# Altium project CHILD_BOARD.PrjPcb (part 1 of 2)
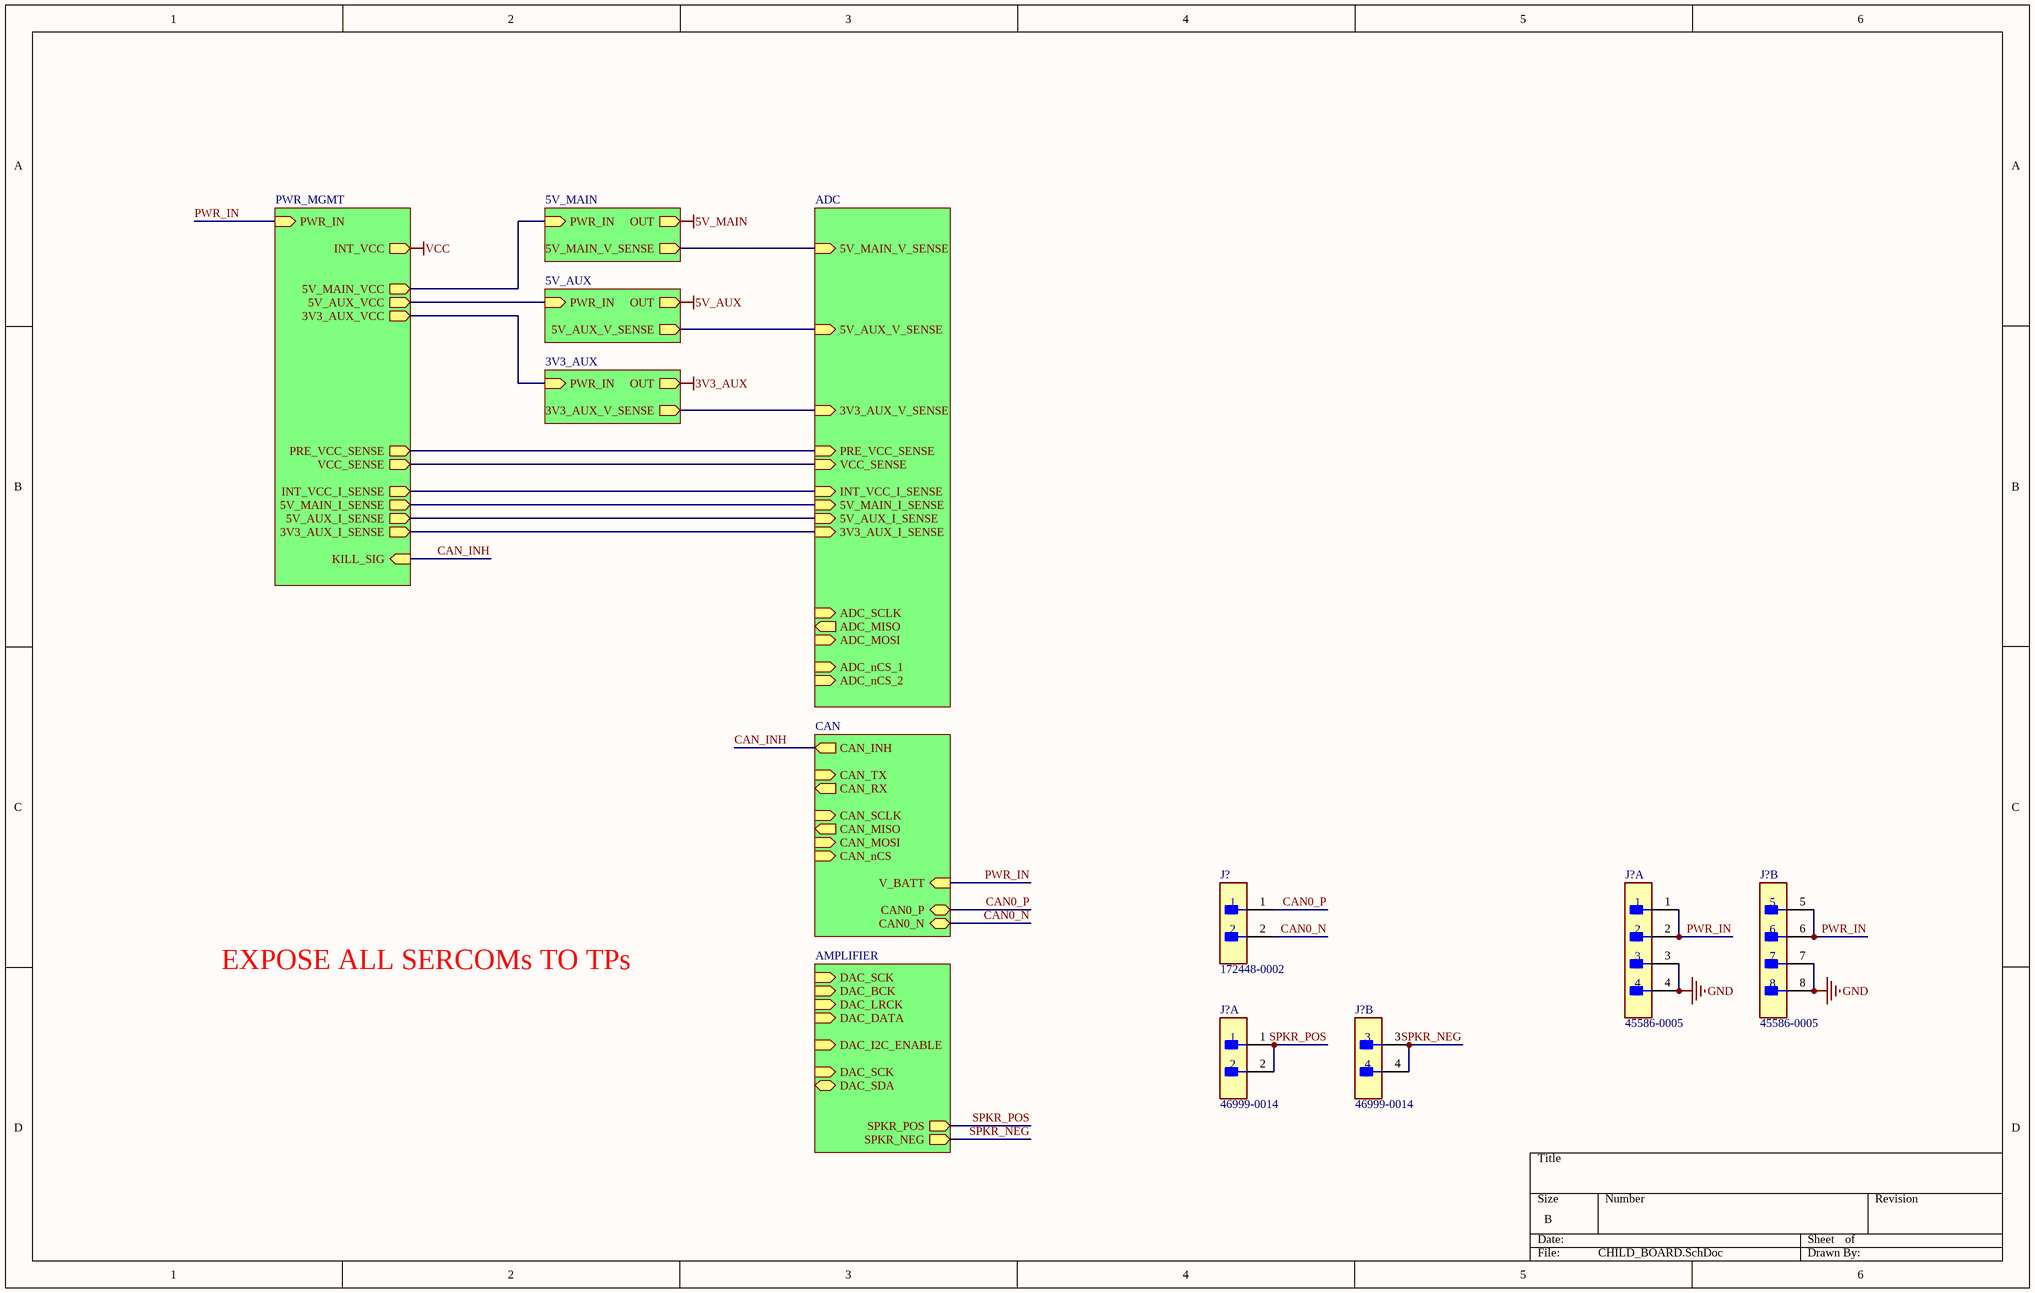
[diagram p0: CHILD_BOARD.SchDoc]
8 sheets, 164 parts. Net scope: hierarchical (ports join the sheet entries above them; power ports are global).
Board file: CHILD_BOARD.PcbDoc
Sheets:
  CHILD_BOARD.SchDoc
    PWR_MGMT = PWR_MGMT.SchDoc
    AMPLIFIER = AMPLIFIER.SchDoc
    CAN = CAN.SchDoc
    5V_MAIN = 5V_MAIN.SchDoc
    5V_AUX = 5V_AUX.SchDoc
    3V3_AUX = 3V3_AUX.SchDoc
    ADC = ADC.SchDoc

## Sheet CHILD_BOARD.SchDoc
size B; SheetNumber: 1; SheetTotal: 8

### Parts
(Parts that share a designator on the sheet are numbered #1, #2 ... from top to bottom, then left to right.)
J?#1  172448-0002  [FP-172448-0002-MFG]
J?#2  45586-0005  [FP-45586-0005-MFG]  (part A of 2)
J?#3  45586-0005  [FP-45586-0005-MFG]  (part B of 2)
J?#4  46999-0014  [FP-46999-0014-MFG]  (part A of 2)
J?#5  46999-0014  [FP-46999-0014-MFG]  (part B of 2)

### Sub-sheets
3V3_AUX = 3V3_AUX: PWR_IN (in), OUT (out), 3V3_AUX_V_SENSE (out)
5V_AUX = 5V_AUX: PWR_IN (in), OUT (out), 5V_AUX_V_SENSE (out)
5V_MAIN = 5V_MAIN: PWR_IN (in), OUT (out), 5V_MAIN_V_SENSE (out)
ADC = ADC: 5V_MAIN_V_SENSE (in), 3V3_AUX_V_SENSE (in), 5V_AUX_V_SENSE (in), INT_VCC_I_SENSE (in), 5V_MAIN_I_SENSE (in), 5V_AUX_I_SENSE (in), 3V3_AUX_I_SENSE (in), PRE_VCC_SENSE (in), VCC_SENSE (in), ADC_SCLK (in), ADC_MISO (out), ADC_MOSI (in), ADC_nCS_1 (in), ADC_nCS_2 (in)
AMPLIFIER = AMPLIFIER: DAC_SCK (in), DAC_BCK (in), DAC_LRCK (in), DAC_DATA (in), DAC_I2C_ENABLE (in), DAC_SCK (in), DAC_SDA (bidir), SPKR_POS (out), SPKR_NEG (out)
CAN = CAN: CAN_TX (in), CAN_RX (out), CAN_SCLK (in), CAN_MISO (out), CAN_MOSI (in), CAN_nCS (in), CAN_INH (out), CAN0_P (bidir), CAN0_N (bidir), V_BATT (in)
PWR_MGMT = PWR_MGMT: PWR_IN (in), INT_VCC (out), 5V_MAIN_VCC (out), 5V_AUX_VCC (out), 3V3_AUX_VCC (out), PRE_VCC_SENSE (out), VCC_SENSE (out), INT_VCC_I_SENSE (out), 5V_MAIN_I_SENSE (out), 5V_AUX_I_SENSE (out), 3V3_AUX_I_SENSE (out), KILL_SIG (in)

### Nets
GND: J?#2.3 J?#2.4 J?#3.7 J?#3.8
SPKR_NEG: J?#5.3 J?#5.4 ; sheet AMPLIFIER/SPKR_NEG
3V3_AUX_I_SENSE: sheet PWR_MGMT/3V3_AUX_I_SENSE, sheet ADC/3V3_AUX_I_SENSE
3V3_AUX_V_SENSE: sheet 3V3_AUX/3V3_AUX_V_SENSE, sheet ADC/3V3_AUX_V_SENSE
3V3_AUX_VCC: sheet PWR_MGMT/3V3_AUX_VCC, sheet 3V3_AUX/PWR_IN
5V_AUX_I_SENSE: sheet PWR_MGMT/5V_AUX_I_SENSE, sheet ADC/5V_AUX_I_SENSE
5V_AUX_V_SENSE: sheet 5V_AUX/5V_AUX_V_SENSE, sheet ADC/5V_AUX_V_SENSE
5V_AUX_VCC: sheet PWR_MGMT/5V_AUX_VCC, sheet 5V_AUX/PWR_IN
5V_MAIN_I_SENSE: sheet PWR_MGMT/5V_MAIN_I_SENSE, sheet ADC/5V_MAIN_I_SENSE
5V_MAIN_V_SENSE: sheet 5V_MAIN/5V_MAIN_V_SENSE, sheet ADC/5V_MAIN_V_SENSE
5V_MAIN_VCC: sheet PWR_MGMT/5V_MAIN_VCC, sheet 5V_MAIN/PWR_IN
CAN0_N: J?#1.2 ; sheet CAN/CAN0_N
CAN0_P: J?#1.1 ; sheet CAN/CAN0_P
CAN_INH: sheet PWR_MGMT/KILL_SIG, sheet CAN/CAN_INH
DAC_SCK: sheet AMPLIFIER/DAC_SCK, sheet AMPLIFIER/DAC_SCK
INT_VCC_I_SENSE: sheet PWR_MGMT/INT_VCC_I_SENSE, sheet ADC/INT_VCC_I_SENSE
PRE_VCC_SENSE: sheet PWR_MGMT/PRE_VCC_SENSE, sheet ADC/PRE_VCC_SENSE
PWR_IN: J?#2.1 J?#2.2 J?#3.5 J?#3.6 ; sheet PWR_MGMT/PWR_IN, sheet CAN/V_BATT
SPKR_POS: J?#4.1 J?#4.2 ; sheet AMPLIFIER/SPKR_POS
VCC_SENSE: sheet PWR_MGMT/VCC_SENSE, sheet ADC/VCC_SENSE

### Notes on the sheet
- EXPOSE ALL SERCOMs TO TPs

### Library data of the parts
J?#1 = CMP-04780-000002-1: CONN HEADER R/A 2POS; Row Spacing: 0.165inch; Number of Circuits: 2; Connector Type: Male Pin; Glow Wire Compliant: Compliant; Number of Pins: 2; Mount: Through Hole; Number of Positions: 2; Number of Rows: 2; Color: Black; Contact Plating: Tin; Fastening Type: Ramp; Termination: Solder; RoHS Compliant: Yes; Packaging: Tray; Orientation: Right Angle
J?#2 J?#3 = CMP-04776-000690-1: CONN HEADER R/A 8POS 4.2MM
J?#4 J?#5 = CMP-04776-000148-1: CONN HEADER R/A 4POS 4.2MM; Gender: Male; Mount: Through Hole; Number of Pins: 4; Termination: Solder; Pitch: 4.2mm; RoHS Compliant: Yes; Orientation: Right Angle

## Sheet PWR_MGMT.SchDoc
size C; SheetNumber: 2; SheetTotal: 8
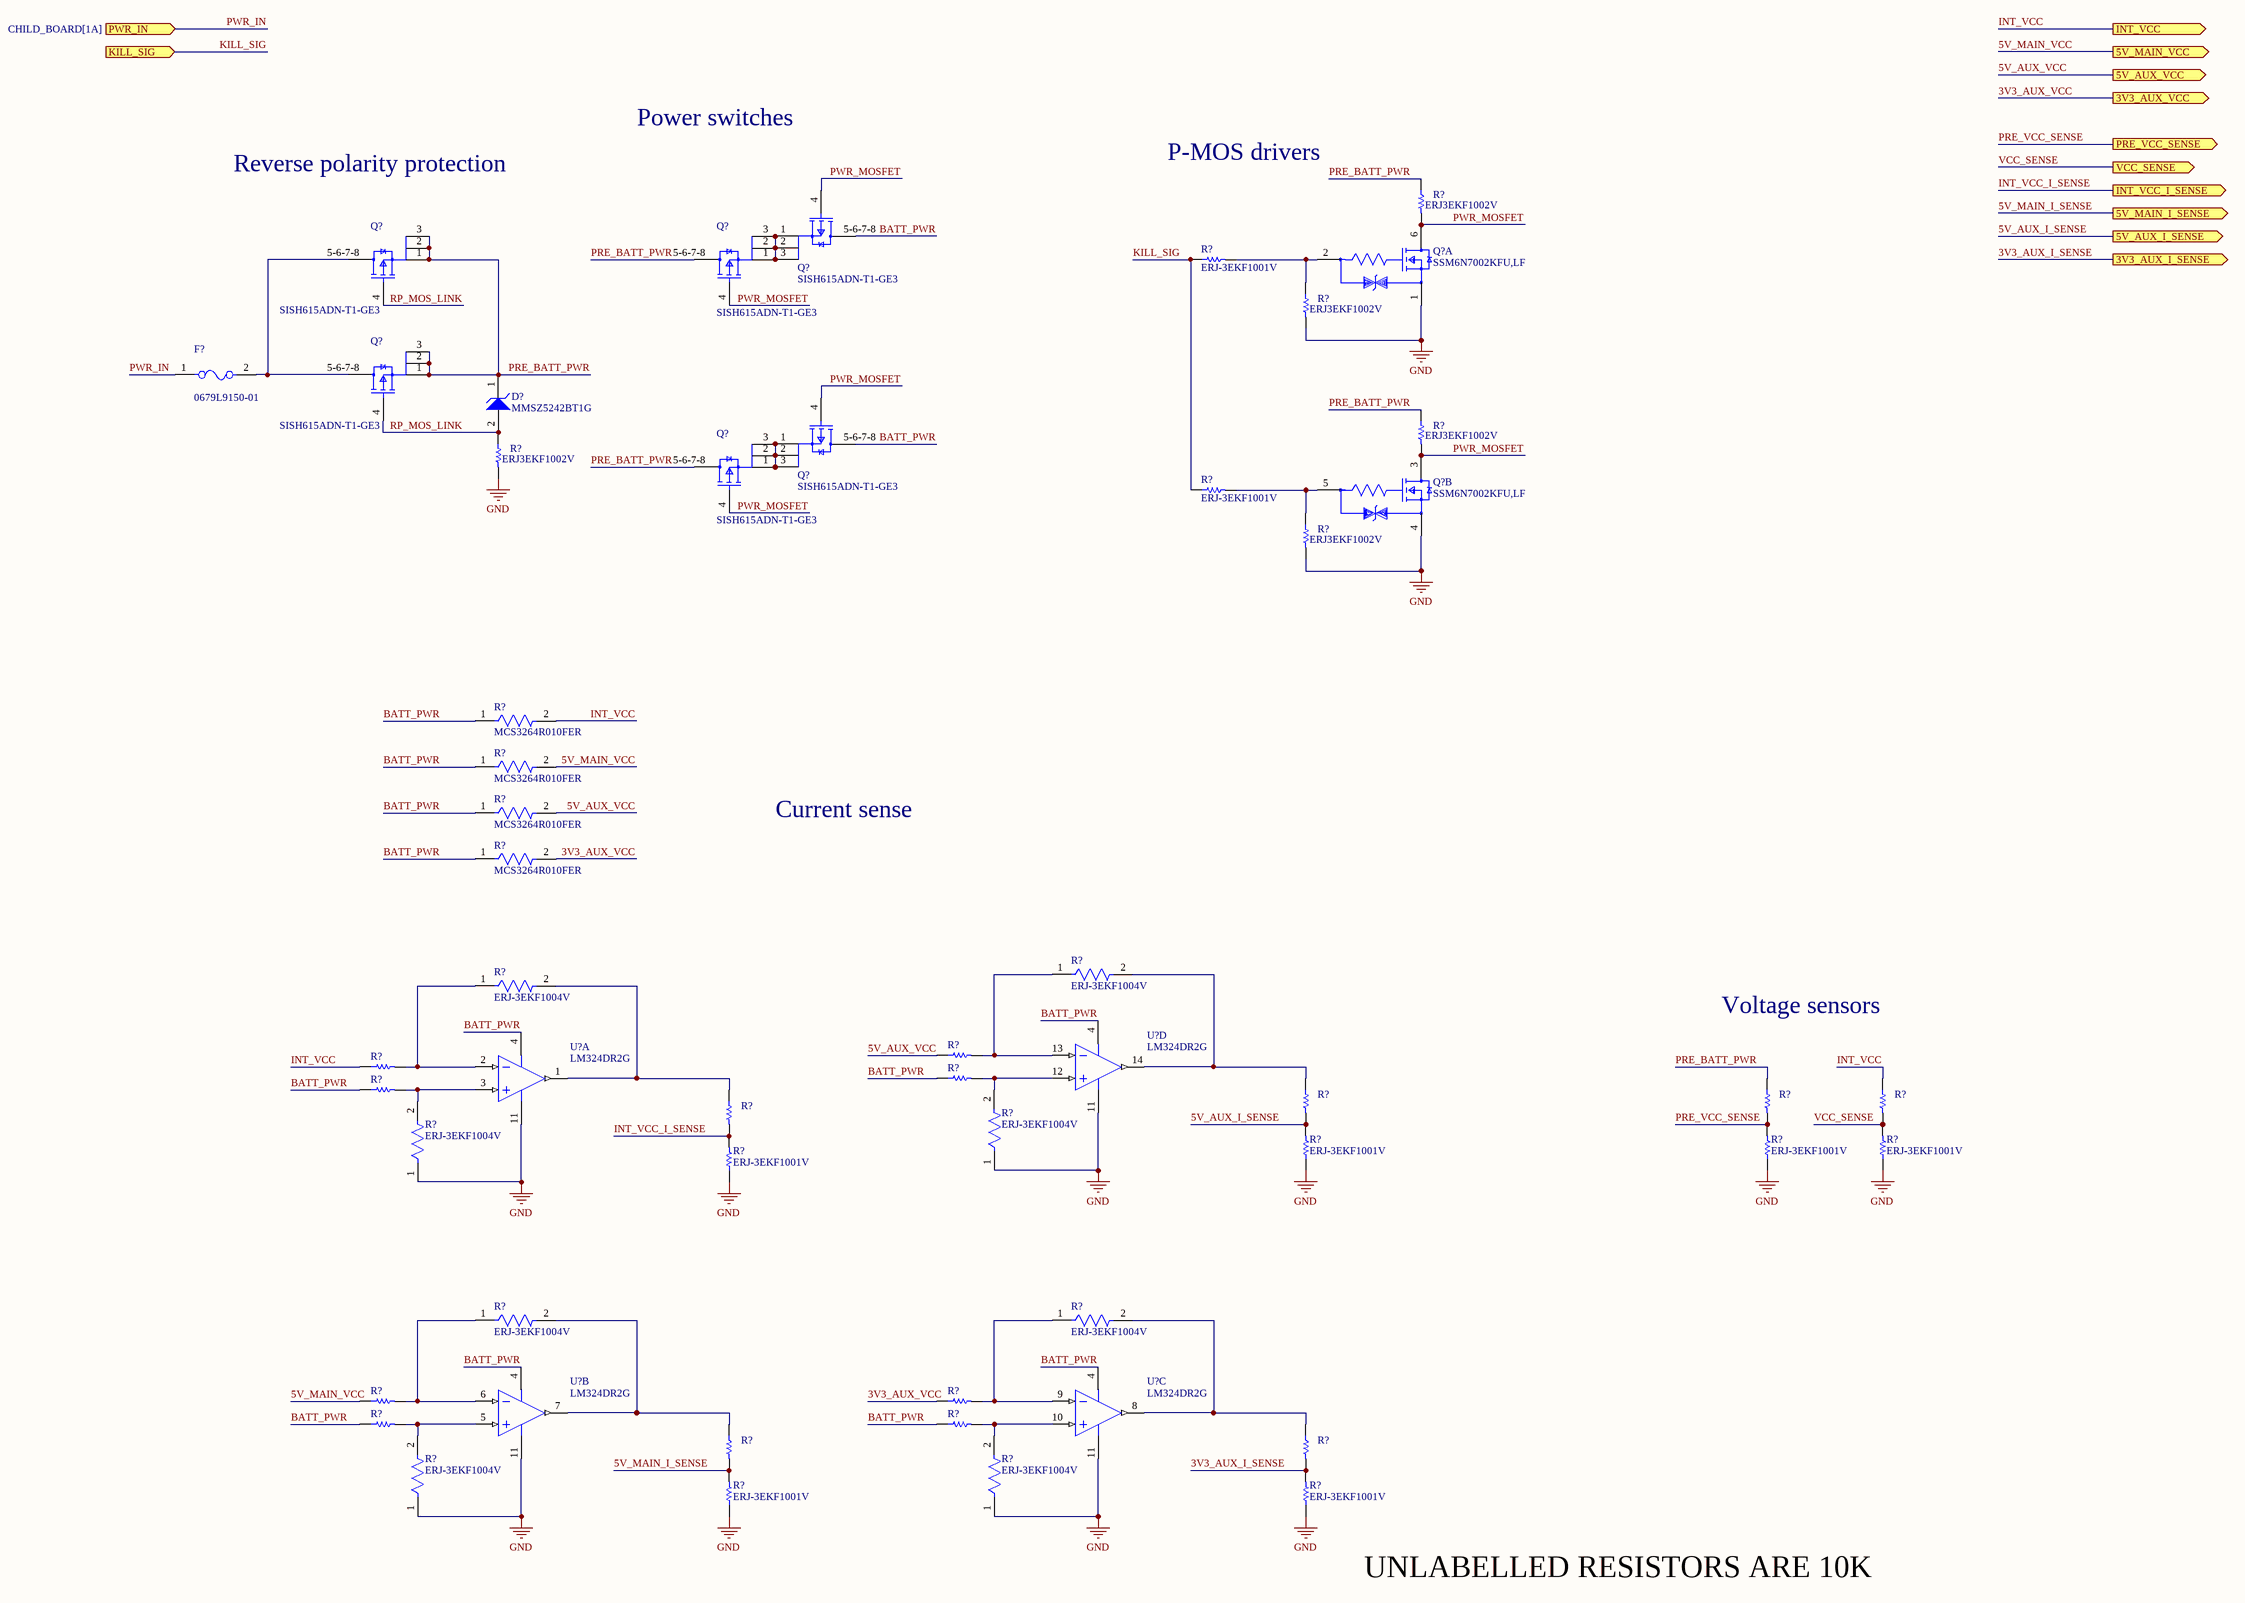
[diagram p1: PWR_MGMT.SchDoc]

### Parts
(Parts that share a designator on the sheet are numbered #1, #2 ... from top to bottom, then left to right.)
D?#1  MMSZ5242BT1G  [ONSC-SOD-123-2-425-04_V]
F?  0679L9150-01  [FP-0679L-MFG]
Q?#1  SISH615ADN-T1-GE3  [SISH615ADN-T1-GE3-Footprint-1]
Q?#2  SSM6N7002KFU,LF  [FP-SSOP6-P-0_65A-MFG]  (part A of 2)
Q?#3  SISH615ADN-T1-GE3  [SISH615ADN-T1-GE3-Footprint-1]
Q?#4  SISH615ADN-T1-GE3  [SISH615ADN-T1-GE3-Footprint-1]
Q?#5  SISH615ADN-T1-GE3  [SISH615ADN-T1-GE3-Footprint-1]
Q?#6  SISH615ADN-T1-GE3  [SISH615ADN-T1-GE3-Footprint-1]
Q?#7  SSM6N7002KFU,LF  [FP-SSOP6-P-0_65A-MFG]  (part B of 2)
Q?#8  SISH615ADN-T1-GE3  [SISH615ADN-T1-GE3-Footprint-1]
R?#1  ERJ3EKF1002V  [RESC1609X55X30LL15T15]
R?#2  ERJ-3EKF1001V  [RESC1608X55X30LL15T15]
R?#3  ERJ3EKF1002V  [RESC1609X55X30LL15T15]
R?#4  ERJ3EKF1002V  [RESC1609X55X30LL15T15]
R?#5  ERJ3EKF1002V  [RESC1609X55X30LL15T15]
R?#6  ERJ-3EKF1001V  [RESC1608X55X30LL15T15]
R?#7  ERJ3EKF1002V  [RESC1609X55X30LL15T15]
R?#8  MCS3264R010FER  [FP-MCS3264-MFG]
R?#9  MCS3264R010FER  [FP-MCS3264-MFG]
R?#10  MCS3264R010FER  [FP-MCS3264-MFG]
R?#11  MCS3264R010FER  [FP-MCS3264-MFG]
R?#12  ERJ-3EKF1004V  [FP-ERJ3EK-IPC_C]
R?#13  ERJ-3EKF1004V  [FP-ERJ3EK-IPC_C]
R?#14  ERJ3EKF1002V  [RESC1609X55X30LL15T15]  (value not drawn)
R?#15  ERJ3EKF1002V  [RESC1609X55X30LL15T15]  (value not drawn)
R?#16  ERJ3EKF1002V  [RESC1609X55X30LL15T15]  (value not drawn)
R?#17  ERJ3EKF1002V  [RESC1609X55X30LL15T15]  (value not drawn)
R?#18  ERJ3EKF1002V  [RESC1609X55X30LL15T15]  (value not drawn)
R?#19  ERJ3EKF1002V  [RESC1609X55X30LL15T15]  (value not drawn)
R?#20  ERJ3EKF1002V  [RESC1609X55X30LL15T15]  (value not drawn)
R?#21  ERJ3EKF1002V  [RESC1609X55X30LL15T15]  (value not drawn)
R?#22  ERJ-3EKF1001V  [RESC1608X55X30LL15T15]
R?#23  ERJ-3EKF1001V  [RESC1608X55X30LL15T15]
R?#24  ERJ-3EKF1001V  [RESC1608X55X30LL15T15]
R?#25  ERJ-3EKF1001V  [RESC1608X55X30LL15T15]
R?#26  ERJ-3EKF1004V  [FP-ERJ3EK-IPC_C]
R?#27  ERJ-3EKF1004V  [FP-ERJ3EK-IPC_C]
R?#28  ERJ-3EKF1004V  [FP-ERJ3EK-IPC_C]
R?#29  ERJ-3EKF1004V  [FP-ERJ3EK-IPC_C]
R?#30  ERJ3EKF1002V  [RESC1609X55X30LL15T15]  (value not drawn)
R?#31  ERJ3EKF1002V  [RESC1609X55X30LL15T15]  (value not drawn)
R?#32  ERJ3EKF1002V  [RESC1609X55X30LL15T15]  (value not drawn)
R?#33  ERJ3EKF1002V  [RESC1609X55X30LL15T15]  (value not drawn)
R?#34  ERJ3EKF1002V  [RESC1609X55X30LL15T15]  (value not drawn)
R?#35  ERJ3EKF1002V  [RESC1609X55X30LL15T15]  (value not drawn)
R?#36  ERJ-3EKF1001V  [RESC1608X55X30LL15T15]
R?#37  ERJ-3EKF1001V  [RESC1608X55X30LL15T15]
R?#38  ERJ-3EKF1004V  [FP-ERJ3EK-IPC_C]
R?#39  ERJ-3EKF1004V  [FP-ERJ3EK-IPC_C]
U?#1  LM324DR2G  [ONSC-SOIC-14-751A-03_V]  (part D of 4)
U?#2  LM324DR2G  [ONSC-SOIC-14-751A-03_V]  (part A of 4)
U?#3  LM324DR2G  [ONSC-SOIC-14-751A-03_V]  (part B of 4)
U?#4  LM324DR2G  [ONSC-SOIC-14-751A-03_V]  (part C of 4)

### Ports
3V3_AUX_I_SENSE (out), 3V3_AUX_VCC (out), 5V_AUX_I_SENSE (out), 5V_AUX_VCC (out), 5V_MAIN_I_SENSE (out), 5V_MAIN_VCC (out), INT_VCC (out), INT_VCC_I_SENSE (out), KILL_SIG (in), PRE_VCC_SENSE (out), PWR_IN (in, see CHILD_BOARD[1A]), VCC_SENSE (out)

### Nets
GND: Q?#2.1(Source1) Q?#7.4(Source2) R?#3.2 R?#5.2 R?#7.2 R?#22.1 R?#23.1 R?#24.1 R?#25.1 R?#26.1 R?#27.1 R?#36.1 R?#37.1 R?#38.1 R?#39.1 U?#1.11(VEE/GND) U?#2.11(VEE/GND) U?#3.11(VEE/GND) U?#4.11(VEE/GND)
INT_VCC: R?#8.2 R?#15.1 R?#20.1 ; port INT_VCC
3V3_AUX_I_SENSE: R?#35.2 R?#37.2 ; port 3V3_AUX_I_SENSE
3V3_AUX_VCC: R?#11.2 R?#31.1 ; port 3V3_AUX_VCC
5V_AUX_I_SENSE: R?#18.2 R?#22.2 ; port 5V_AUX_I_SENSE
5V_AUX_VCC: R?#10.2 R?#14.1 ; port 5V_AUX_VCC
5V_MAIN_I_SENSE: R?#34.2 R?#36.2 ; port 5V_MAIN_I_SENSE
5V_MAIN_VCC: R?#9.2 R?#30.1 ; port 5V_MAIN_VCC
BATT_PWR: Q?#1.5-6-7-8(D) Q?#5.5-6-7-8(D) R?#8.1 R?#9.1 R?#10.1 R?#11.1 R?#16.1 R?#17.1 R?#32.1 R?#33.1 U?#1.4(VCC) U?#2.4(VCC) U?#3.4(VCC) U?#4.4(VCC)
INT_VCC_I_SENSE: R?#21.2 R?#25.2 ; port INT_VCC_I_SENSE
KILL_SIG: R?#2.1 R?#6.1 ; port KILL_SIG  [project net CAN_INH]
PRE_BATT_PWR: D?#1.1(K) Q?#3.1(S) Q?#3.2(S) Q?#3.3(S) Q?#4.5-6-7-8(D) Q?#6.1(S) Q?#6.2(S) Q?#6.3(S) Q?#8.5-6-7-8(D) R?#1.1 R?#4.1 R?#19.1
PRE_VCC_SENSE: R?#19.2 R?#23.2 ; port PRE_VCC_SENSE
PWR_IN: F?.1 ; port PWR_IN
PWR_MOSFET: Q?#1.4(G) Q?#2.6(Drain1) Q?#4.4(G) Q?#5.4(G) Q?#7.3(Drain2) Q?#8.4(G) R?#1.2 R?#4.2
RP_MOS_LINK: D?#1.2(A) Q?#3.4(G) Q?#6.4(G) R?#5.1
VCC_SENSE: R?#20.2 R?#24.2 ; port VCC_SENSE
NetF?_2: F?.2 Q?#3.5-6-7-8(D) Q?#6.5-6-7-8(D)
NetQ?#1_1: Q?#1.1(S) Q?#1.2(S) Q?#1.3(S) Q?#4.1(S) Q?#4.2(S) Q?#4.3(S)
NetQ?#2_2: Q?#2.2(Gate1) R?#2.2 R?#3.1
NetQ?#5_1: Q?#5.1(S) Q?#5.2(S) Q?#5.3(S) Q?#8.1(S) Q?#8.2(S) Q?#8.3(S)
NetQ?#7_5: Q?#7.5(Gate2) R?#6.2 R?#7.1
NetR?#12_1: R?#12.1 R?#14.2 U?#1.13(IN4-)
NetR?#12_2: R?#12.2 R?#18.1 U?#1.14(OUT4)
NetR?#13_1: R?#13.1 R?#15.2 U?#2.2(IN1-)
NetR?#13_2: R?#13.2 R?#21.1 U?#2.1(OUT1)
NetR?#16_2: R?#16.2 R?#26.2 U?#1.12(IN4+)
NetR?#17_2: R?#17.2 R?#27.2 U?#2.3(IN1+)
NetR?#28_1: R?#28.1 R?#30.2 U?#3.6(IN2-)
NetR?#28_2: R?#28.2 R?#34.1 U?#3.7(OUT2)
NetR?#29_1: R?#29.1 R?#31.2 U?#4.9(IN3-)
NetR?#29_2: R?#29.2 R?#35.1 U?#4.8(OUT3)
NetR?#32_2: R?#32.2 R?#38.2 U?#3.5(IN2+)
NetR?#33_2: R?#33.2 R?#39.2 U?#4.10(IN3+)

### Notes on the sheet
- Power switches
- P-MOS drivers
- Reverse polarity protection
- Current sense
- Voltage sensors
- UNLABELLED RESISTORS ARE 10K

### Library data of the parts
D?#1 = CMP-1060-00565-1: Zener Voltage Regulator, 500 mW, 2-Pin SOD-123, Pb-Free, Tape and Reel; Manufacturer: On Semiconductor; P Max (W): 0.5; VZ Typ (V): 12; PartNumber: MMSZ5242BT1G; PackageReference: SOD-123-2-425-04; ComponentLink3URL: http://www.onsemi.com/pub_link/Collateral/425-04.PDF; Mounting Technology: Surface Mount; ComponentLink2Description: Datasheet; ComponentLink1URL: http://www.onsemi.com/; ComponentLink3Description: Package Specification; PackageDescription: 2-Pin SOD, Body 1.6 x 2.69 mm; PackageVersion: Rev. G, 10/2009; ComponentLink1Description: Manufacturer URL; RoHS: Pb-Free; ComponentLink2URL: http://www.onsemi.com/pub_link/Collateral/MMSZ5221BT1-D.PDF; Packing: Tape and Reel; DatasheetVersion: Rev. 12
F? = CMP-16042-000002-1: FUSE BRD MNT 15A 125VAC/VDC; Manufacturer: Bel Fuse; Max Fuse Ac Voltage: 125V; Fuse Blow Speed: Fast; Fuse I2T: 103.5A2Sec; Fuse Interrupt Ac Current: 50A; Automotive Grade: Grade 1; Value: 0.0038Ω; Fuse Interrupt Dc Current: 300A; Fuse Voltage Drop: 0.13V; Device Class L2: Fuses; ComponentLink2URL: https://www.belfuse.com/resources/CircuitProtection/datasheets/0679L%20Sep2016.pdf; Package: 0679L; Height: 2.79mm; Digikey Description: FUSE BRD MNT 15A 125VAC/VDC; Temperature Range High: +125°C; Device Class L3: unset; Octopart: https://octopart.com/0679l9150-01-bel+fuse-70850665; Temperature Range Low: -55°C; Fuse Current: 15A; Max Fuse Dc Voltage: 125V; Ipc Land Pattern Name: CAPC610254X254; Manufacturer Part Number: 0679L9150-01; Category: Fuse; Lead Free: Yes; Automotive: Yes; Resistance: 0.0038Ω; RoHS: TRUE; Device Class L1: Circuit Protection; ComponentLink2Description: Datasheet; Temperature: -55°C to +125°C; Voltage Rating: 125V
Q?#1 Q?#3-Q?#6 Q?#8 = CMP-013-00036-2: Trans MOSFET P-CH 20V 22.1A 8-Pin PowerPAK 1212 EP T/R
Q?#2 Q?#7 = CMP-35916-000009-1: MOSFET 2N-CH 60V 0.3A; Input Capacitance: 40pF; Continuous Drain Current (ID): 300mA; Max Power Dissipation: 285mW; FET Type: 2 N-Channel; Rds On Max: 1.5R; Mount: Surface Mount; Drain to Source Voltage (Vdss): 60V; Packaging: Tape and Reel
R?#1 R?#3-R?#5 R?#7 R?#14-R?#21 R?#30-R?#35 = CMP-1012-00623-3: Chip Resistor, 10 KOhm, +/- 1%, 0.1 W, -55 to 155 degC, 0603 (1608 Metric), RoHS, Tape and Reel; Manufacturer: Panasonic; Voltage Rating: 75V; Case\/Package: 0603; Power Rating: 100mW; Resistance: 10KOhm; Temperature Coefficient: 100ppm\/degreesC; Number of Pins: 2; Package Reference: 603; Depth: 0.8mm; Mount: SurfaceMount; Package Description: 2-Pin Surface Mount Device, Body 1.6 x 0.85 mm; Datasheet Version: 02/2017; Length: 1.6mm; Lead Free: LeadFree; Height: 0.45mm; Number of Terminations: 2; Max Power Dissipation: 100mW; Min Operating Temperature: -55degC; Datasheet URL: https://industrial.panasonic.com/cdbs/www-data/pdf/RDA0000/AOA0000C304.pdf; Termination: SMD/SMT; Case Code (Metric): 1608; Case Code (Imperial): 0603; Tolerance: 1%; Max Operating Temperature: 155degC; RoHSCompliant: true; Voltage Rating (DC): 75V; Radiation Hardening: No; Packaging: TapeandReel; Composition: ThickFilm; Mounting Technology: SurfaceMount; Manufacturer URL: http://www.panasonic.com/; Width: 0.031inch; REACH SVHC: NoSVHC; Contact Plating: Tin; Military Standard: Not; Package Quantity: 1
R?#2 R?#6 R?#22-R?#25 R?#36 R?#37 = CMP-2000-00180-1: Manufacturer: Panasonic; Part Number: ERJ-3EKF1001V
R?#8-R?#11 = CMP-33361-000012-1: RES SMD 10 MOHM 1% 2W 3264; Temperature Coefficient: 50ppm/°C; Resistance: 10mR; Voltage Rating: 220mV; Case/Package: 2512; Military Standard: Not; Max Operating Temperature: 150°C; Height: 0.024inch; Package Quantity: 1; Case Code (Imperial): 2512; Number of Terminations: 2; Features: Flame Retardant Coating; Width: 0.126inch; Tolerance: 1%; Composition: Metal Element; Number of Pins: 2; Packaging: Tape and Reel; Depth: 3.2mm; Termination: SMD/SMT; Min Operating Temperature: -55°C; Power Rating: 2W; Case Code (Metric): 6432; Max Power Dissipation: 2W; Mount: Surface Mount; Length: 6.4mm
R?#12 R?#13 R?#26-R?#29 R?#38 R?#39 = CMP-1012-00849-3: RES SMD 1M OHM 1% 1/10W 0603; Resistance: 1MR; Voltage Rating: 75V; Temperature Coefficient: 100ppm/°C; Power Rating: 100mW; REACH SVHC: No SVHC; Radiation Hardening: No; Features: Automotive AEC-Q200; Case Code (Metric): 1608; Resistance Tolerance: 1%; Case/Package: 0603; Termination: SMD/SMT; Max Operating Temperature: 155°C; Tolerance: 1%; Size Code: 0603; Case Code (Imperial): 0603; Min Operating Temperature: -55°C; Number of Pins: 2; Mount: Surface Mount; Package Quantity: 1; Military Standard: Not; Voltage Rating (DC): 75V; Depth: 0.8mm; Packaging: Tape and Reel; Width: 0.8mm; Number of Terminations: 2; Length: 1.6mm; Height: 0.022inch; RoHS Compliant: Yes; Resistor Type: Thick Film; Contact Plating: Tin; Lead Free: Lead Free; Series: ERJ; Construction: Rectangular; Max Power Dissipation: 100mW
U?#1-U?#4 = CMP-1310-00171-1: Single Supply Quad Operational Amplifier, 3 to 32 V, 0 to 70 degC, 14-Pin SOIC, Pb-Free, Tape and Reel; Manufacturer: On Semiconductor; VCC Max (V): 32; VCC Min (V): 3; PackageVersion: Rev. K, 05/2011; ComponentLink3URL: http://www.onsemi.com/pub_link/Collateral/751A-03.PDF; ComponentLink3Description: Package Specification; Packing: Tape and Reel; ComponentLink2URL: http://www.onsemi.cn/pub_link/Collateral/LM324-D.PDF; PackageReference: SOIC-14-751A-03; ComponentLink1URL: http://www.onsemi.com/; PackageDescription: 14-Pin Small Outline Integrated Circuit, Body 8.65 x 3.9 mm, Pitch 1.27 mm; ComponentLink1Description: Manufacturer URL; DatasheetVersion: Rev. 25; Mounting Technology: Surface Mount; RoHS: TRUE; ComponentLink2Description: Datasheet; PartNumber: LM324DR2G

## Sheet AMPLIFIER.SchDoc
size B; SheetNumber: 4; SheetTotal: 8
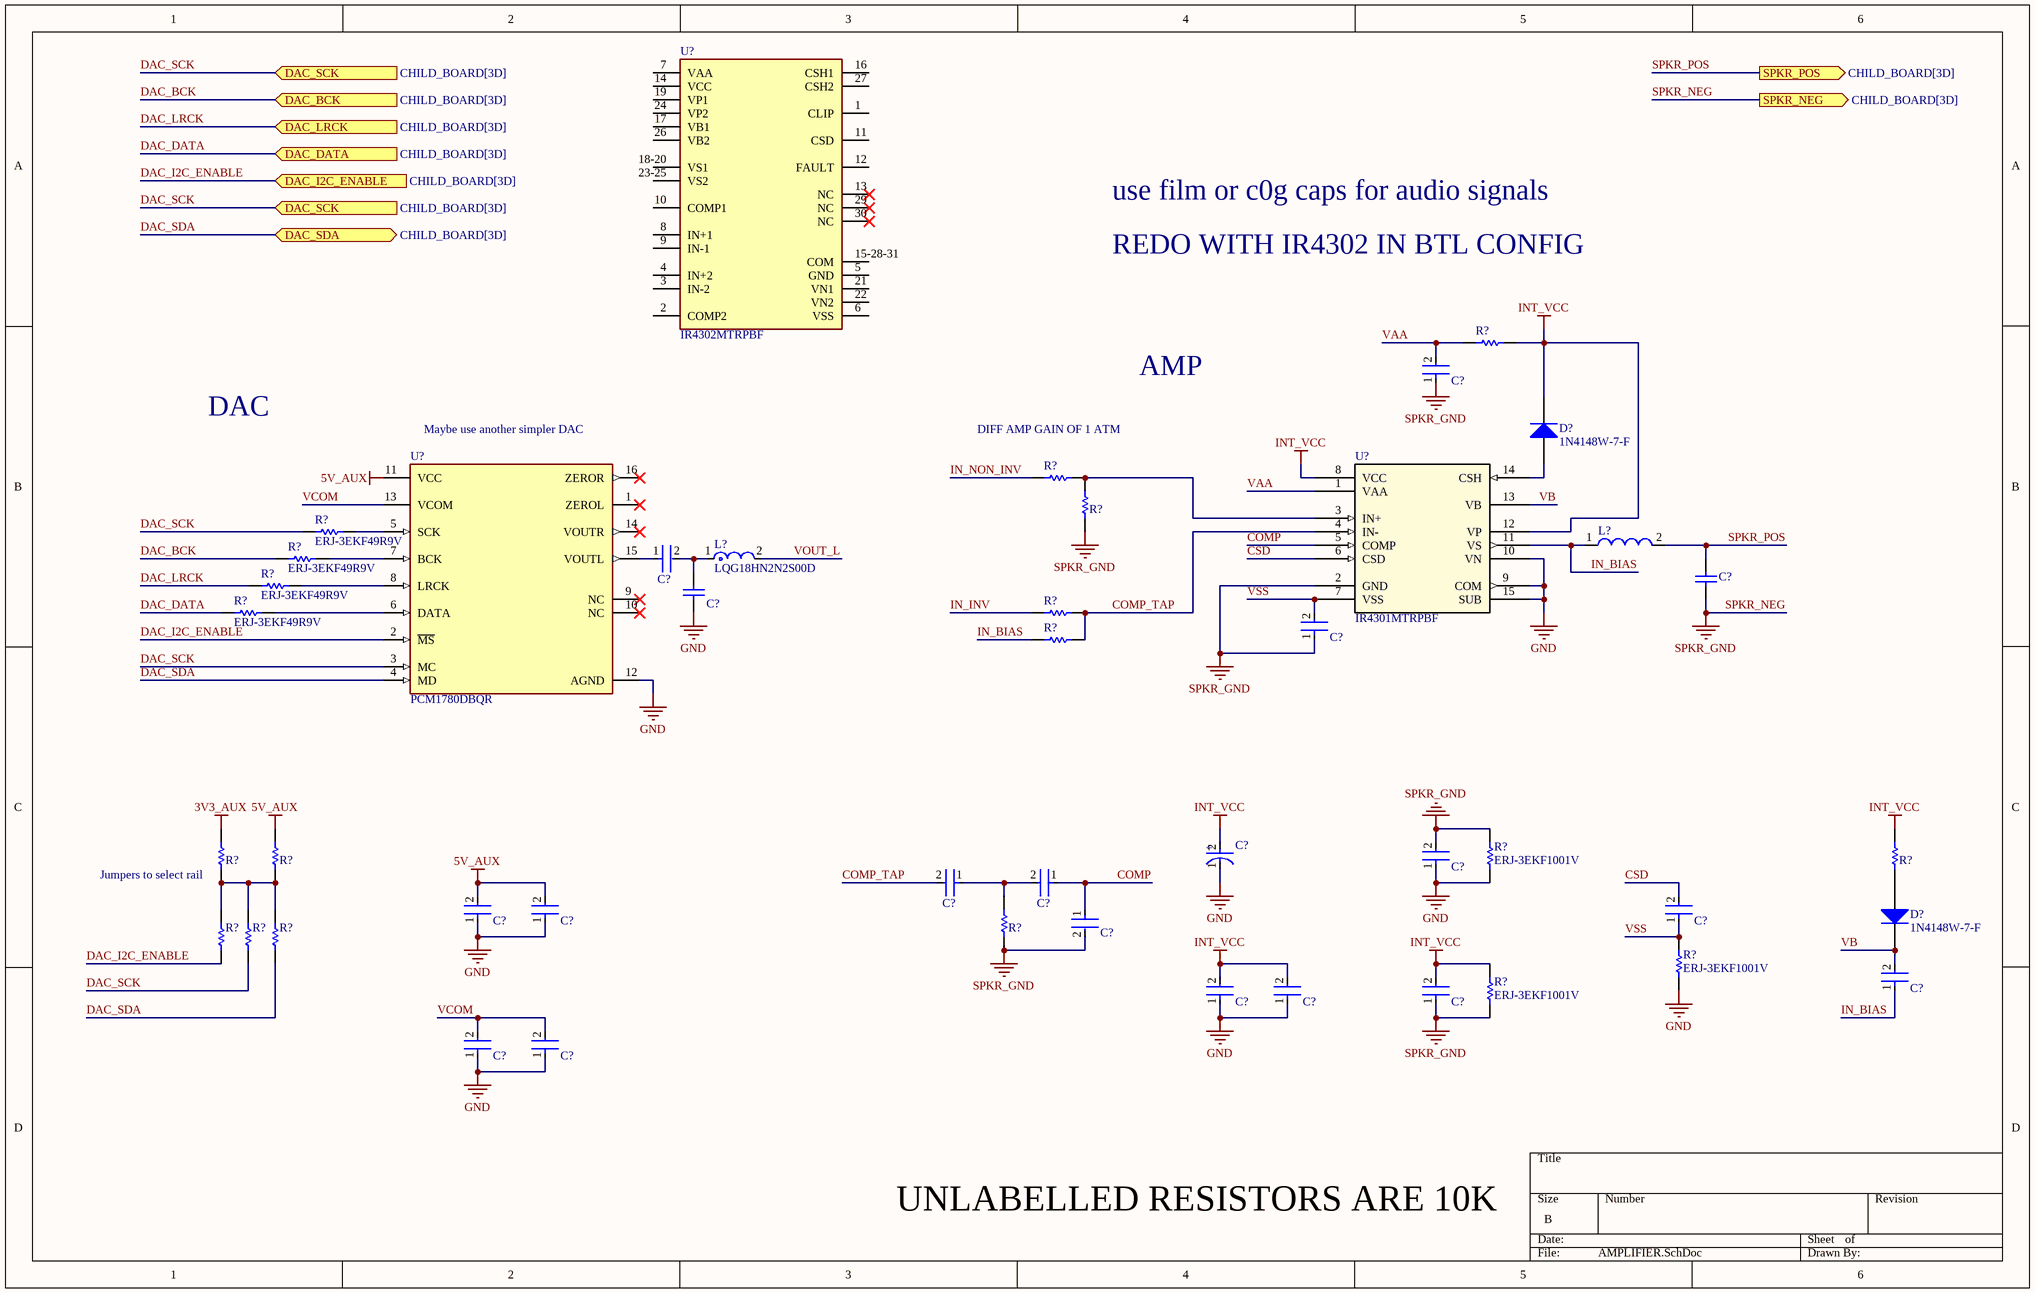
[diagram p2: AMPLIFIER.SchDoc]

### Parts
(Parts that share a designator on the sheet are numbered #1, #2 ... from top to bottom, then left to right.)
C?#1  C1005X7R1H104K050BB  [FP-C1005-050-0_05-IPC_C]  (value not drawn)
C?#2  GRM188R60J106ME47D  [FP-GRM188-0_1-e0_2_0_55-IPC_A]  (value not drawn)
C?#3  CAP 470nF 50V 1812(4532)  [CAPC1812(4532)230_N]  (value not drawn)
C?#4  0603 CAP  [CAPC1608X90X40ML10T20]  (value not drawn)
C?#5  C1005X7R1H104K050BB  [FP-C1005-050-0_05-IPC_C]  (value not drawn)
C?#6  EEV-FK1E222M  [FP-FKJ16-MFG]  (value not drawn)
C?#7  GRM188R60J106ME47D  [FP-GRM188-0_1-e0_2_0_55-IPC_A]  (value not drawn)
C?#8  C1005X7R1H104K050BB  [FP-C1005-050-0_05-IPC_C]  (value not drawn)
C?#9  C1005X7R1H104K050BB  [FP-C1005-050-0_05-IPC_C]  (value not drawn)
C?#10  C1005X7R1H104K050BB  [FP-C1005-050-0_05-IPC_C]  (value not drawn)
C?#11  GRM188R60J106ME47D  [FP-GRM188-0_1-e0_2_0_55-IPC_A]  (value not drawn)
C?#12  C1005X7R1H104K050BB  [FP-C1005-050-0_05-IPC_C]  (value not drawn)
C?#13  C1005X7R1H104K050BB  [FP-C1005-050-0_05-IPC_C]  (value not drawn)
C?#14  C1005X7R1H104K050BB  [FP-C1005-050-0_05-IPC_C]  (value not drawn)
C?#15  GRM188R60J106ME47D  [FP-GRM188-0_1-e0_2_0_55-IPC_A]  (value not drawn)
C?#16  C1005X7R1H104K050BB  [FP-C1005-050-0_05-IPC_C]  (value not drawn)
C?#17  GRM188R60J106ME47D  [FP-GRM188-0_1-e0_2_0_55-IPC_A]  (value not drawn)
C?#18  GRM188R60J106ME47D  [FP-GRM188-0_1-e0_2_0_55-IPC_A]  (value not drawn)
C?#19  C1005X7R1H104K050BB  [FP-C1005-050-0_05-IPC_C]  (value not drawn)
D?#2  1N4148W-7-F  [DIOD-SOD123-2_V]
D?#3  1N4148W-7-F  [DIOD-SOD123-2_V]
L?#1  74477110  [WE-PD-L]  (value not drawn)
L?#2  LQG18HN2N2S00D  [FP-LQG18HH_00-IPC_A]
R?#40  ERJ3EKF1002V  [RESC1609X55X30LL15T15]  (value not drawn)
R?#41  ERJ3EKF1002V  [RESC1609X55X30LL15T15]  (value not drawn)
R?#42  ERJ3EKF1002V  [RESC1609X55X30LL15T15]  (value not drawn)
R?#43  ERJ-3EKF49R9V  [RESC1608X55X30ML15T15]
R?#44  ERJ-3EKF49R9V  [RESC1608X55X30ML15T15]
R?#45  ERJ-3EKF49R9V  [RESC1608X55X30ML15T15]
R?#46  ERJ3EKF1002V  [RESC1609X55X30LL15T15]  (value not drawn)
R?#47  ERJ-3EKF49R9V  [RESC1608X55X30ML15T15]
R?#48  ERJ3EKF1002V  [RESC1609X55X30LL15T15]  (value not drawn)
R?#49  ERJ3EKF1002V  [RESC1609X55X30LL15T15]  (value not drawn)
R?#50  0402 JUMPER 0 OHM  [RESC1005X40X25NL05T05]  (value not drawn)
R?#51  0402 JUMPER 0 OHM  [RESC1005X40X25NL05T05]  (value not drawn)
R?#52  ERJ-3EKF1001V  [RESC1608X55X30LL15T15]
R?#53  ERJ3EKF1002V  [RESC1609X55X30LL15T15]  (value not drawn)
R?#54  ERJ3EKF1002V  [RESC1609X55X30LL15T15]  (value not drawn)
R?#55  ERJ3EKF1002V  [RESC1609X55X30LL15T15]  (value not drawn)
R?#56  ERJ3EKF1002V  [RESC1609X55X30LL15T15]  (value not drawn)
R?#57  ERJ-3EKF1001V  [RESC1608X55X30LL15T15]
R?#58  ERJ-3EKF1001V  [RESC1608X55X30LL15T15]
U?#5  IR4302MTRPBF  [FP-IR4302MTRPBF-MFG]
U?#6  PCM1780DBQR  [FP-DBQ0016A-IPC_C]
U?#7  IR4301MTRPBF  [IR4301MTRPBF-Footprint-1]

### Ports
DAC_BCK (in, see CHILD_BOARD[3D]), DAC_DATA (in, see CHILD_BOARD[3D]), DAC_I2C_ENABLE (in, see CHILD_BOARD[3D]), DAC_LRCK (in, see CHILD_BOARD[3D]), DAC_SCK (in, see CHILD_BOARD[3D]), DAC_SDA (bidir, see CHILD_BOARD[3D]), SPKR_NEG (out, see CHILD_BOARD[3D]), SPKR_POS (out, see CHILD_BOARD[3D])

### Nets
3V3_AUX: R?#50.2  [project net 3V3_AUX_FB]
5V_AUX: C?#11.2 C?#12.2 R?#51.2 U?#6.11(VCC)  [project net 5V_AUX_FB]
GND: C?#4.1 C?#6.1(C) C?#7.1 C?#11.1 C?#12.1 C?#15.1 C?#16.1 C?#18.1 C?#19.1 R?#52.1 R?#57.1 U?#6.12(AGND) U?#7.9(COM) U?#7.10(VN) U?#7.15(SUB)
INT_VCC: C?#6.2(A) C?#15.2 C?#16.2 C?#17.2 D?#2.2(K) R?#40.2 R?#49.1 R?#58.2 U?#7.8(VCC) U?#7.12(VP)
SPKR_NEG: C?#1.1 C?#3.1 C?#5.1 C?#7.2 C?#10.2 C?#17.1 R?#42.1 R?#52.2 R?#53.1 R?#58.1 U?#7.2(GND) ; port SPKR_NEG  [also labelled SPKR_GND]
COMP: C?#9.1 C?#10.1 U?#7.5(COMP)
COMP_TAP: C?#8.2 R?#46.2 R?#48.2 U?#7.4(IN-)
CSD: C?#13.2 U?#7.6(CSD)
DAC_BCK: R?#44.2 ; port DAC_BCK
DAC_DATA: R?#47.2 ; port DAC_DATA
DAC_I2C_ENABLE: R?#54.1 U?#6.2(~{MS}) ; port DAC_I2C_ENABLE
DAC_LRCK: R?#45.2 ; port DAC_LRCK
DAC_SCK: R?#43.2 R?#55.1 U?#6.3(MC) ; port DAC_SCK
DAC_SDA: R?#56.1 U?#6.4(MD) ; port DAC_SDA
IN_BIAS: C?#14.1 L?#1.1 R?#48.1 U?#7.11(VS)
IN_INV: R?#46.1
IN_NON_INV: R?#41.1
SPKR_POS: C?#3.2 L?#1.2 ; port SPKR_POS
VAA: C?#1.2 R?#40.1 U?#7.1(VAA)
VB: C?#14.2 D?#3.2(K) U?#7.13(VB)
VCOM: C?#18.2 C?#19.2 U?#6.13(VCOM)
VOUT_L: L?#2.2
VSS: C?#5.2 C?#13.1 R?#57.2 U?#7.7(VSS)
NetC?#2_1: C?#2.1 U?#6.15(VOUTL)
NetC?#2_2: C?#2.2 C?#4.2 L?#2.1
NetC?#8_1: C?#8.1 C?#9.2 R?#53.2
NetD?#2_1: D?#2.1(A) U?#7.14(CSH)
NetD?#3_1: D?#3.1(A) R?#49.2
NetR?#41_2: R?#41.2 R?#42.2 U?#7.3(IN+)
NetR?#43_1: R?#43.1 U?#6.5(SCK)
NetR?#44_1: R?#44.1 U?#6.7(BCK)
NetR?#45_1: R?#45.1 U?#6.8(LRCK)
NetR?#47_1: R?#47.1 U?#6.6(DATA)
NetR?#50_1: R?#50.1 R?#51.1 R?#54.2 R?#55.2 R?#56.2

Not connected (* = marked no-connect by the designer): U?#5 1(CLIP) 2(COMP2) 3(IN-2) 4(IN+2) 5(GND) 6(VSS) 7(VAA) 8(IN+1) 9(IN-1) 10(COMP1) 11(CSD) 12(FAULT) 13(NC)* 14(VCC) 15-28-31(COM) 16(CSH1) 17(VB1) 18-20(VS1) 19(VP1) 21(VN1) 22(VN2) 23-25(VS2) 24(VP2) 26(VB2) 27(CSH2) 29(NC)* 30(NC)*; U?#6 1(ZEROL)* 9(NC)* 10(NC)* 14(VOUTR)* 16(ZEROR)*

### Notes on the sheet
- use film or c0g caps for audio signals
- REDO WITH IR4302 IN BTL CONFIG
- DAC
- (near U?#6) Maybe use another simpler DAC
- (near R?#41) DIFF AMP GAIN OF 1 ATM
- AMP
- (near R?#50) Jumpers to select rail
- UNLABELLED RESISTORS ARE 10K
- (in symbol CMP-00287-39480675-1) +

### Library data of the parts
C?#1 C?#5 C?#8-C?#10 C?#12-C?#14 C?#16 C?#19 = CMP-2000-05393-2: Multilayer Ceramic Capacitors 100nF ±10% 50V X7R SMD 0402; Voltage: 50V; Dielectric Material: Ceramic; Min Operating Temperature: -55°C; Depth: 0.5mm; Radiation Hardening: No; RoHS Compliant: Yes; Voltage Rating (DC): 50V; Lead Free: Lead Free; Resistor Type: Ceramic; Height: 0.5mm; Dielectric: X7R; Thickness: 0.022inch; Case/Package: 0402; Case Code (Metric): 1005; Termination: SMD/SMT; Capacitance: 100nF; Packaging: Tape and Reel; Max Operating Temperature: 125°C; Mount: Surface Mount; Package Quantity: 1; Width: 0.02inch; Weight: 2.3E-05oz; Voltage Rating: 50V; Tolerance: 10%; Construction: Flat; Case Code (Imperial): 0402; Length: 1mm; REACH SVHC: No SVHC; Series: C
C?#2 C?#7 C?#11 C?#15 C?#17 C?#18 = CMP-2006-02792-2: Chip Multilayer Ceramic Capacitors for General Purpose, 0603, 10uF, X5R, 15%, 20%, 6.3V; Packaging: Tape and Reel; Voltage Rating (DC): 6.3V; Width: 0.031inch; Termination: SMD/SMT; Dielectric: X5R; Package Quantity: 4000; Voltage Rating: 6.3V; Capacitance: 10uF; Case/Package: 0603; Min Operating Temperature: -55°C; Voltage: 6.3V; Length: 1.6mm; Thickness: 0.035inch; Lead Free: Lead Free; Depth: 0.8mm; Case Code (Imperial): 0603; Max Operating Temperature: 85°C; Material: Ceramic; Height: 0.8mm; Tolerance: 20%; Mount: Surface Mount; REACH SVHC: No SVHC; Radiation Hardening: No; Case Code (Metric): 1608
C?#3 = CMP-1040-01541-1: CAP 470nF 50V ±10% 1812 (4532 Metric) Thickness 2.3mm SMD; Case-Metric: 4532; Tolerance: Â±10%; Case-EIA: 1812; Value: 470nF; Technology: SMT; Max Thickness: 2.3 mm; Rated Voltage: 50 V
C?#4 = CMP-001-00087-1: 0pF 0603 capacitor placeholder
C?#6 = CMP-00287-39480675-1: EEV-FK1E222M Aluminum Electrolytic Capacitor, Polarized, Aluminum (wet), 35V, 20% +Tol, 20% -Tol, 100uF; Voltage: 25V; Leakage Current: 3µA; ESR (Equivalent Series Resistance): 35mΩ; Capacitance: 2.2mF; Ripple Current (AC): 1.8A; Life (Hours): 2000hours; Case/Package: Radial; Max Operating Temperature: 105°C; Packaging: Cut Tape; Height: 16.5mm; Radiation Hardening: No; Lifecycle Status: Production; Contact Plating: Tin; Tolerance: 20%; REACH SVHC: No SVHC; NexarPartId: 39480675; Voltage Rating (DC): 25V; Diameter: 16mm; Width: 1.2mm; Mount: PCB, Surface Mount; Length: 17mm; Termination: SMD/SMT; Lead Free: Lead Free; Height - Seated (Max): 16.51mm; Ripple Current: 1.8A; Schedule B: 8532220020, 8532220020; Voltage Rating: 25V; Impedance: 35mΩ; RoHS: Compliant; Min Operating Temperature: -55°C
D?#2 D?#3 = CMP-2000-04932-2: Fast Switching Diode, 100 V, 0.15 A, -65 to 150 degC, 2-Pin?SOD123, RoHS, Tape and Reel; Recovery Time: 4ns; Brand: DiodesIncorporated; Unit Weight: 0.000353oz; Max Surge Current: 2A; Peak Reverse Voltage: 100V; Ir - Reverse Current: 1uA; Vf - Forward Voltage: 1.25V; Configuration: Single; If - Forward Current: 0.15A; Product Category: Diodes-GeneralPurpose,Power,Switching; Operating Temperature Range: -65Cto+150C; Packaging: Reel; Manufacturer URL: http://www.diodes.com/; Maximum Operating Temperature: +150C; Height: 1.25mm; Minimum Operating Temperature: -65C; Product: SwitchingDiodes; Package URL: http://www.diodes.com/datasheets/ds18004.pdf; Type: SwitchingDiode; Package Reference: SOD123-2; Width: 1.7mm; Datasheet URL: http://www.farnell.com/datasheets/1915529.pdf; Datasheet Version: Rev. 24-2, 10/2013; Series: 1N4148; Factory Pack Quantity: 3000; Length: 2.85mm; RoHS: True; Manufacturer: DiodesIncorporated; Mounting Style: SMD/SMT; Package / Case: SOD-123
L?#1 = CMP-0227-00708-1: SMD-Shielded Power Inductor WE-PD, L = 10.0 µH; Inductance: 10.0 ÂµH; ComponentLink2Description: Datasheet; DatasheetVersion: ver 7, Sep-2006; PackageVersion: 2006; ComponentLink1URL: http://www.we-online.com; ComponentLink1Description: Manufacturer Link; ComponentLink2URL: http://www.we-online.de/katalog/media/pdf/74477110.pdf; PackageDescription: SMD Inductor, 2-Leads, Body 12.0 x 12.0 mm; PackageReference: WE-PD-L
L?#2 = CMP-06042-006288-1: Multilayer type RF Inductor 2.2nH ±0.3nH 0.1Ω 1100mA 0603; Max DC Current: 500mA; Core Material: Air; Self Resonant Frequency: 6GHz; Q Factor: 12; DC Resistance (DCR): 100mR; Shielding: Unshielded; Test Frequency: 100MHz; Inductance: 2.2nH; Depth: 0.95mm; Current Rating: 500mA; Packaging: Tape and Reel; Case/Package: 0603; Height - Seated (Max): 0.037inch; Mount: Surface Mount; Radiation Hardening: No; Max Operating Temperature: 85°C; Length: 0.063inch; Termination: SMD/SMT; Lead Free: Lead Free; Min Operating Temperature: -40°C; Number of Pins: 2; Case Code (Metric): 1608; Height: 0.8mm; REACH SVHC: No SVHC; Package Quantity: 4000; DC Current: 500mA; Width: 0.031inch; Military Standard: Not; Case Code (Imperial): 0603
R?#40-R?#42 R?#46 R?#48 R?#49 R?#53-R?#56 = CMP-1012-00623-3: as R?#1 on sheet PWR_MGMT; Number of Pins: 2; Package Reference: 603; Depth: 0.8mm; Mount: SurfaceMount; Package Description: 2-Pin Surface Mount Device, Body 1.6 x 0.85 mm; Datasheet Version: 02/2017; Length: 1.6mm; Lead Free: LeadFree; Height: 0.45mm; Number of Terminations: 2; Max Power Dissipation: 100mW; Min Operating Temperature: -55degC; Datasheet URL: https://industrial.panasonic.com/cdbs/www-data/pdf/RDA0000/AOA0000C304.pdf; Termination: SMD/SMT; Case Code (Metric): 1608; Case Code (Imperial): 0603; Tolerance: 1%; Max Operating Temperature: 155degC; RoHSCompliant: true; Voltage Rating (DC): 75V; Radiation Hardening: No; Packaging: TapeandReel; Composition: ThickFilm; Mounting Technology: SurfaceMount; Manufacturer URL: http://www.panasonic.com/; Width: 0.031inch; REACH SVHC: NoSVHC; Contact Plating: Tin; Military Standard: Not; Package Quantity: 1
R?#43-R?#45 R?#47 = CMP-2000-00538-1: Manufacturer: Panasonic; Part Number: ERJ-3EKF49R9V
R?#50 R?#51 = CMP-009-00206-2: READ THE NAME
R?#52 R?#57 R?#58 = CMP-2000-00180-1: Manufacturer: Panasonic; Part Number: ERJ-3EKF1001V
U?#5 = CMP-32833-000008-1: IC AMP CLASS D STEREO 130W 44QFN; Operating Supply Voltage: 80V; Max Power Dissipation: 25W; Gain Bandwidth Product: 9MHz; Number of Channels: 2; Max Supply Voltage: 15V; Output Power: 70W; Number of Pins: 44; Lead Free: Lead Free; RoHS Compliant: Yes; Series: -; Packaging: Cut Tape; Max Operating Temperature: 100°C; Package Quantity: 1; Halogen Free: Halogen Free; Mount: Surface Mount; Min Operating Temperature: -40°C; Max Output Power: 130W; Contact Plating: Tin
U?#6 = CMP-04861-000034-1: IC DAC/AUDIO 24BIT 200K 16SSOP; Number of Channels: 2; Operating Supply Voltage: 5V; Conversion Rate: 192KS/s; Number of Analog Inputs: 0; Number of Bits: 24; Max Supply Voltage: 5.5V; Min Supply Voltage: 4.5V; Signal to Noise Ratio (SNR): 106dB; Max Power Dissipation: 200mW; Resolution: 24b; Interface: Serial; Output Type: Voltage; Sampling Rate: 200000S/s; Supply Type: Single; Power Consumption: 80mW; Nominal Supply Current: 30mA; Radiation Hardening: No; Number of Pins: 16; Packaging: Tape and Reel; Lead Free: Lead Free; Min Operating Temperature: -25°C; Number of Analog Outputs: 2; Weight: 0.002469oz; Package Quantity: 2000; Series: -; Number of Converters: 2; Case/Package: SSOP; Number of DAC Channels: 2; RoHS Compliant: Yes; Max Operating Temperature: 85°C; Mount: Surface Mount
U?#7 = CMP-014-00006-1: IR4301 Series 15 V Integrated Analog Input Class D Audio Amplifier - PQFN-22

## Sheet CAN.SchDoc
size A; SheetNumber: 3; SheetTotal: 8
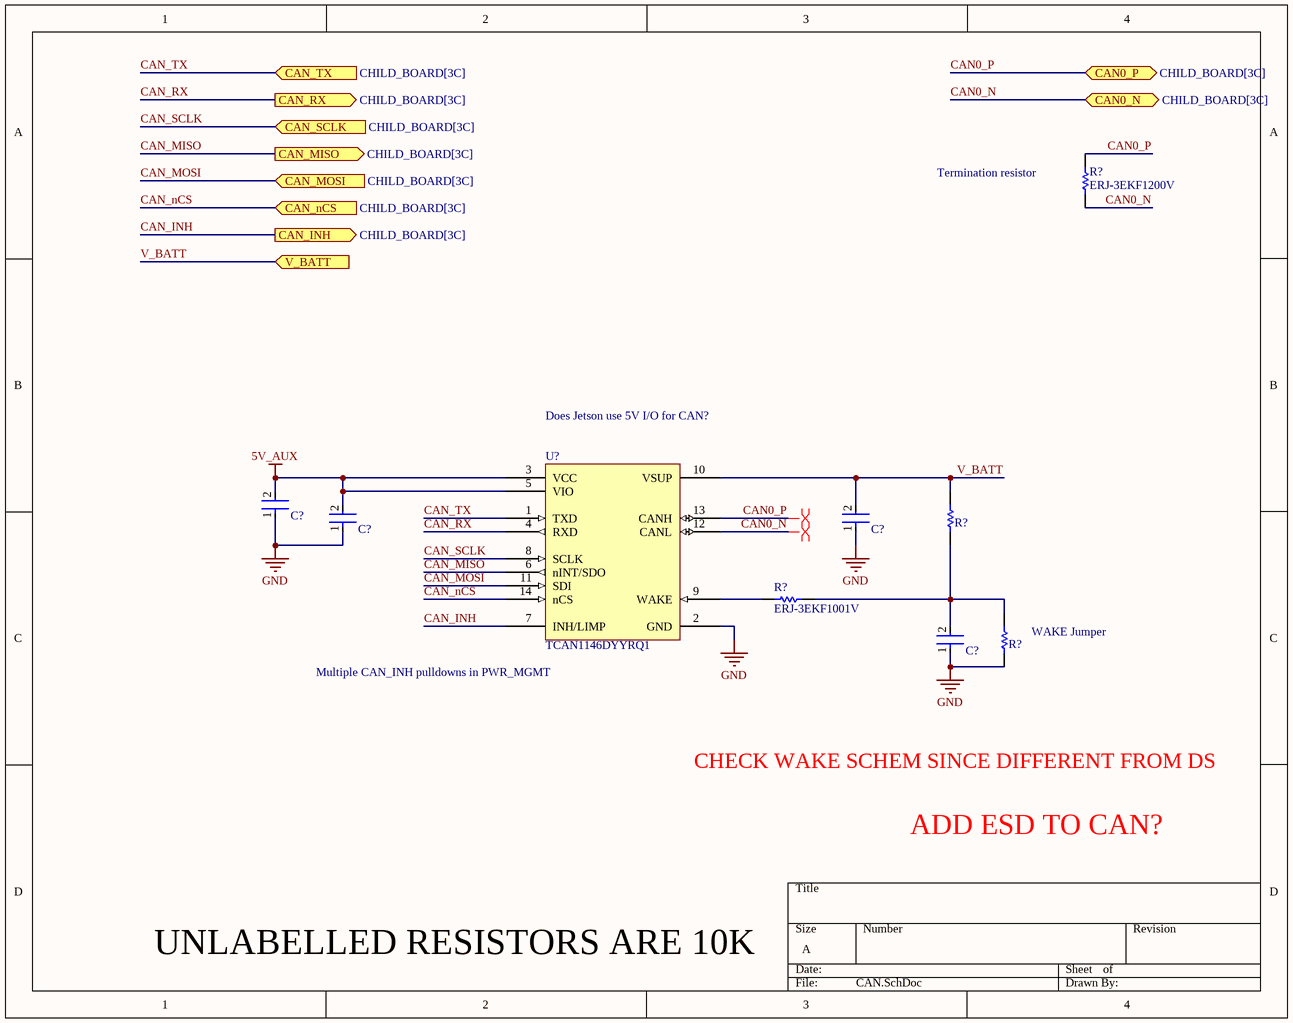
[diagram p3: CAN.SchDoc]

### Parts
(Parts that share a designator on the sheet are numbered #1, #2 ... from top to bottom, then left to right.)
C?#20  C0402C104K8PACTU  [FP-C0402-BB-MFG]  (value not drawn)
C?#21  C0402C104K8PACTU  [FP-C0402-BB-MFG]  (value not drawn)
C?#22  C0402C104K8PACTU  [FP-C0402-BB-MFG]  (value not drawn)
C?#23  C0402C104K8PACTU  [FP-C0402-BB-MFG]  (value not drawn)
R?#59  ERJ-3EKF1200V  [RESC1609X55X30ML15T15]
R?#60  ERJ3EKF1002V  [RESC1609X55X30LL15T15]  (value not drawn)
R?#61  ERJ-3EKF1001V  [RESC1608X55X30LL15T15]
R?#62  0402 JUMPER 0 OHM  [RESC1005X40X25NL05T05]  (value not drawn)
U?#8  TCAN1146DYYRQ1  [TCAN1146DYYRQ1-Footprint-1]

### Ports
CAN0_N (bidir, see CHILD_BOARD[3C]), CAN0_P (bidir, see CHILD_BOARD[3C]), CAN_INH (out, see CHILD_BOARD[3C]), CAN_MISO (out, see CHILD_BOARD[3C]), CAN_MOSI (in, see CHILD_BOARD[3C]), CAN_nCS (in, see CHILD_BOARD[3C]), CAN_RX (out, see CHILD_BOARD[3C]), CAN_SCLK (in, see CHILD_BOARD[3C]), CAN_TX (in, see CHILD_BOARD[3C]), V_BATT (in)

### Nets
5V_AUX: C?#20.2 C?#21.2 U?#8.3(VCC) U?#8.5(VIO)  [project net 5V_AUX_FB]
GND: C?#20.1 C?#21.1 C?#22.1 C?#23.1 R?#62.1 U?#8.2(GND)
CAN0_N: R?#59.1 U?#8.12(CANL) ; port CAN0_N
CAN0_P: R?#59.2 U?#8.13(CANH) ; port CAN0_P
CAN_INH: U?#8.7(INH/LIMP) ; port CAN_INH
CAN_MISO: U?#8.6(nINT/SDO) ; port CAN_MISO
CAN_MOSI: U?#8.11(SDI) ; port CAN_MOSI
CAN_nCS: U?#8.14(nCS) ; port CAN_nCS
CAN_RX: U?#8.4(RXD) ; port CAN_RX
CAN_SCLK: U?#8.8(SCLK) ; port CAN_SCLK
CAN_TX: U?#8.1(TXD) ; port CAN_TX
V_BATT: C?#22.2 R?#60.1 U?#8.10(VSUP) ; port V_BATT  [project net PWR_IN]
NetC?#23_2: C?#23.2 R?#60.2 R?#61.2 R?#62.2
NetR?#61_1: R?#61.1 U?#8.9(WAKE)

### Layout directives
differential pair: CAN0_N, CAN0_P

### Notes on the sheet
- (near R?#59) Termination resistor
- Does Jetson use 5V I/O for CAN?
- (near R?#62) WAKE Jumper
- (near U?#8) Multiple CAN_INH pulldowns in PWR_MGMT
- CHECK WAKE SCHEM SINCE DIFFERENT FROM DS
- ADD ESD TO CAN?
- UNLABELLED RESISTORS ARE 10K

### Library data of the parts
C?#20-C?#23 = CMP-2008-02046-2: CAP CER 0.1UF 10V X5R 0402; Manufacturer: Kemet; Material: Ceramic; Capacitance: 0.10 μF; Temperature Coefficient: 15%; Tolerance: 0.1; Value: 0.10 μF; Package: C0402-BB; Temperature: -55°C to +125°C; ComponentLink2Description: Datasheet; Temperature Characteristic: X5R; Device Class L1: Passive Components; Height: 0.55mm; Lead Free: Yes; ComponentLink2URL: https://content.kemet.com/datasheets/KEM_C1002_X7R_SMD.pdf; Device Class L2: Capacitors; Temperature Range Low: -55°C; Temperature Range High: +125°C; RoHS: TRUE; Octopart: https://octopart.com/c0402c104k8pactu-kemet-140039; Automotive: No; Mouser Description: Capacitor 100 nF 10 VDC 0402; Category: Cap; Voltage Rating: 10 V; Digikey Description: CAP CER 0.1UF 10V X5R 0402; Ipc Land Pattern Name: CAPC10050X50; Device Class L3: Ceramic Capacitors; Manufacturer Part Number: C0402C104K8PACTU
R?#59 = CMP-2000-00213-2: Chip Resistor, 120 Ohm, +/- 1%, 0.1 W, -55 to 155 degC, 0603 (1608 Metric), RoHS, Tape and Reel; Manufacturer: Panasonic; Power Rating: 100mW; Voltage Rating (DC): 75V; Resistance: 120Ohm; Temperature Coefficient: 100ppm/degreesC; Number of Terminations: 2; Military Standard: Not; Tolerance: 1%; Min Operating Temperature: -55degC; Packaging: TapeandReel; Lead Free: LeadFree; Max Operating Temperature: 155degC; Manufacturer URL: http://www.panasonic.com/; Case Code (Imperial): 0603; REACH SVHC: NoSVHC; Width: 0.031inch; Datasheet URL: https://industrial.panasonic.com/cdbs/www-data/pdf/RDA0000/AOA0000C283.pdf; RoHSCompliant: true; Max Power Dissipation: 100mW; Termination: SMD/SMT; Package Reference: 0603; Height: 0.022inch; Depth: 0.8mm; Package Description: 2-Pin Surface Mount Device, Body 1.6 x 0.85 mm; Contact Plating: Tin; Length: 1.6mm; Package URL: http://www.st.com/st-web-ui/static/active/en/resource/technical/document/datasheet/CD00001320.pdf; Radiation Hardening: No; Package Quantity: 1; Number of Pins: 2; Datasheet Version: 42095.0; Voltage Rating: 75V; Composition: ThickFilm; Case/Package: 0603; Mount: SurfaceMount; Case Code (Metric): 1608
R?#60 = CMP-1012-00623-3: as R?#1 on sheet PWR_MGMT; Number of Pins: 2; Package Reference: 603; Depth: 0.8mm; Mount: SurfaceMount; Package Description: 2-Pin Surface Mount Device, Body 1.6 x 0.85 mm; Datasheet Version: 02/2017; Length: 1.6mm; Lead Free: LeadFree; Height: 0.45mm; Number of Terminations: 2; Max Power Dissipation: 100mW; Min Operating Temperature: -55degC; Datasheet URL: https://industrial.panasonic.com/cdbs/www-data/pdf/RDA0000/AOA0000C304.pdf; Termination: SMD/SMT; Case Code (Metric): 1608; Case Code (Imperial): 0603; Tolerance: 1%; Max Operating Temperature: 155degC; RoHSCompliant: true; Voltage Rating (DC): 75V; Radiation Hardening: No; Packaging: TapeandReel; Composition: ThickFilm; Mounting Technology: SurfaceMount; Manufacturer URL: http://www.panasonic.com/; Width: 0.031inch; REACH SVHC: NoSVHC; Contact Plating: Tin; Military Standard: Not; Package Quantity: 1
R?#61 = CMP-2000-00180-1: Manufacturer: Panasonic; Part Number: ERJ-3EKF1001V
R?#62 = CMP-009-00206-2: READ THE NAME
U?#8 = CMP-015-00012-2: Automotive CAN FD transceiver with watchdog, bus diagnostics and partial networking via sele 14-SOT-23-THIN -40 to 150

## Sheet 5V_MAIN.SchDoc
size A4; SheetNumber: 5; SheetTotal: 8
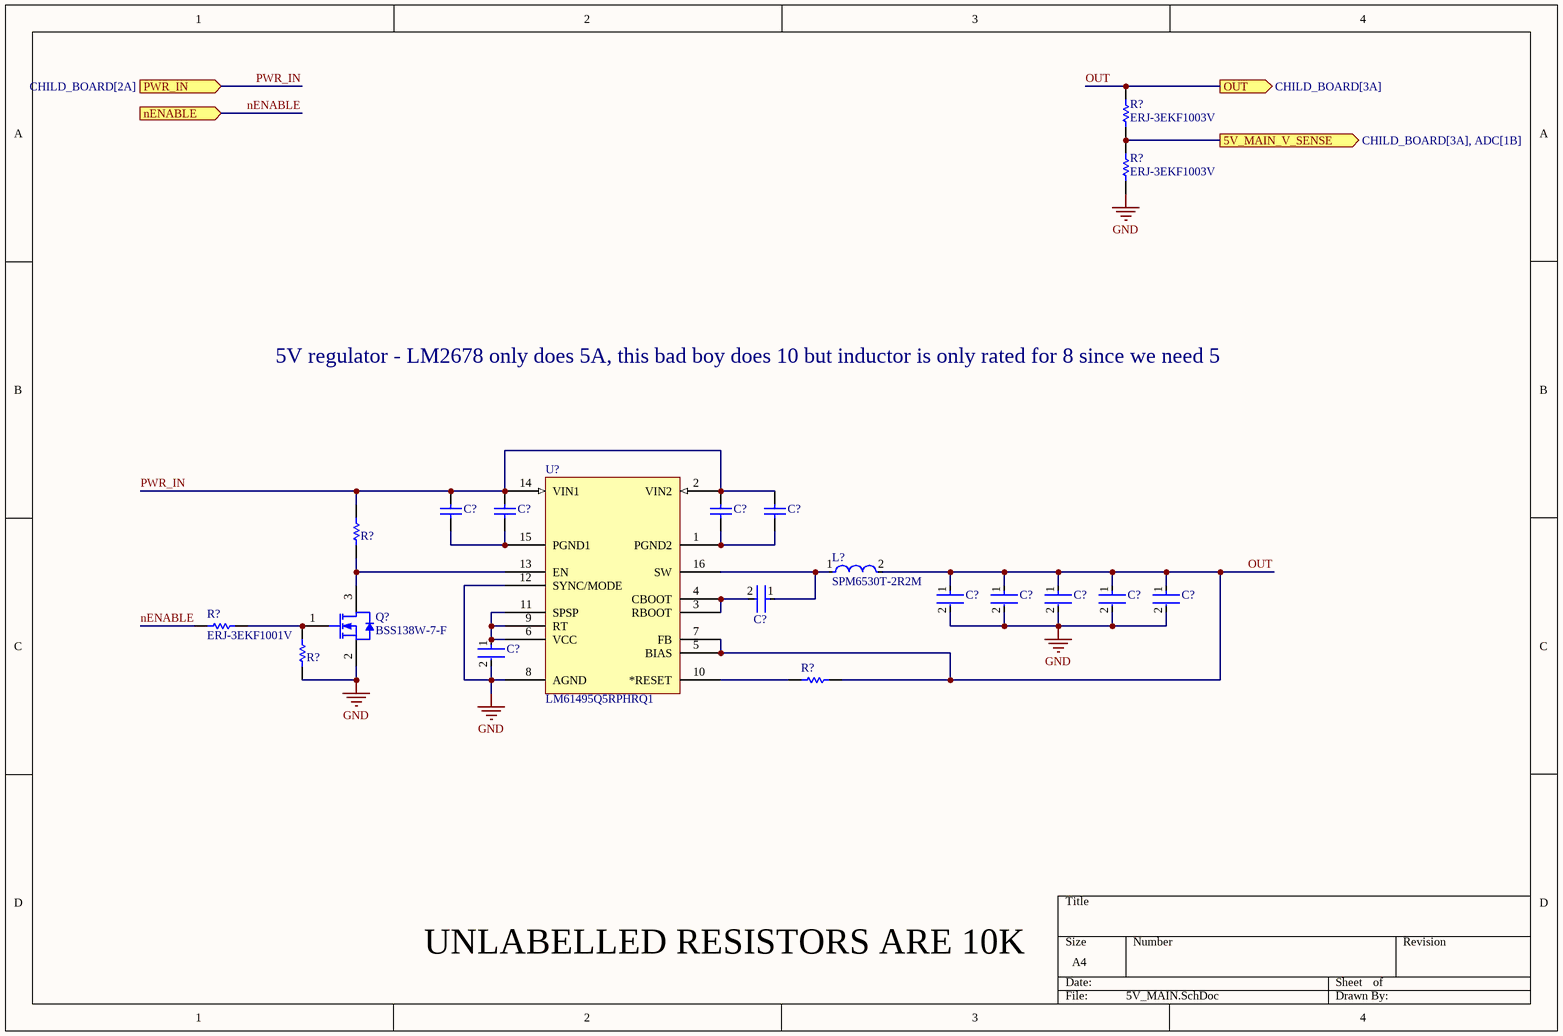
[diagram p4: 5V_MAIN.SchDoc]

### Parts
(Parts that share a designator on the sheet are numbered #1, #2 ... from top to bottom, then left to right.)
C?#24  GRM219R61E106KA12D  [CAPC2013X95X45ML10T25]  (value not drawn)
C?#25  CAP 470nF 50V 1812(4532)  [CAPC1812(4532)125_M]  (value not drawn)
C?#26  CAP 470nF 50V 1812(4532)  [CAPC1812(4532)125_M]  (value not drawn)
C?#27  GRM219R61E106KA12D  [CAPC2013X95X45ML10T25]  (value not drawn)
C?#28  GRM21BR61E226ME44L  [FP-GRM21B-0_2-e0_2_0_7-IPC_B]  (value not drawn)
C?#29  GRM21BR61E226ME44L  [FP-GRM21B-0_2-e0_2_0_7-IPC_B]  (value not drawn)
C?#30  GRM21BR61E226ME44L  [FP-GRM21B-0_2-e0_2_0_7-IPC_B]  (value not drawn)
C?#31  GRM21BR61E226ME44L  [FP-GRM21B-0_2-e0_2_0_7-IPC_B]  (value not drawn)
C?#32  GRM21BR61E226ME44L  [FP-GRM21B-0_2-e0_2_0_7-IPC_B]  (value not drawn)
C?#33  C1005X7R1H104K050BB  [FP-C1005-050-0_05-IPC_C]  (value not drawn)
C?#34  UMK107AB7105KA-T  [FP-0603-L_1_6_0_15-W_0_8-IPC_C]  (value not drawn)
L?#3  SPM6530T-2R2M  [FP-SPM6530-MFG]
Q?#9  BSS138W-7-F  [DIOD-SOT323-3_V]
R?#63  ERJ-3EKF1003V  [RESC1608X55X30ML15T15]
R?#64  ERJ-3EKF1003V  [RESC1608X55X30ML15T15]
R?#65  ERJ3EKF1002V  [RESC1609X55X30LL15T15]  (value not drawn)
R?#66  ERJ-3EKF1001V  [RESC1608X55X30LL15T15]
R?#67  ERJ3EKF1002V  [RESC1609X55X30LL15T15]  (value not drawn)
R?#68  ERJ3EKF1002V  [RESC1609X55X30LL15T15]  (value not drawn)
U?#9  LM61495Q5RPHRQ1  [LM61495Q5RPHRQ1-Footprint-1]

### Ports
5V_MAIN_V_SENSE (out, see CHILD_BOARD[3A], ADC[1B]), nENABLE (in), OUT (out, see CHILD_BOARD[3A]), PWR_IN (in, see CHILD_BOARD[2A])

### Nets
GND: C?#28.2 C?#29.2 C?#30.2 C?#31.2 C?#32.2 C?#34.2 Q?#9.2(S) R?#64.1 R?#67.1 U?#9.8(AGND) U?#9.12(SYNC/MODE)
OUT: C?#28.1 C?#29.1 C?#30.1 C?#31.1 C?#32.1 L?#3.2 R?#63.2 R?#68.2 U?#9.5(BIAS) U?#9.7(FB) ; port OUT
5V_MAIN_V_SENSE: R?#63.1 R?#64.2 ; port 5V_MAIN_V_SENSE
nENABLE: R?#66.1 ; port nENABLE
PWR_IN: C?#24.2 C?#25.2 C?#26.2 C?#27.2 R?#65.2 U?#9.2(VIN2) U?#9.14(VIN1) ; port PWR_IN  [project net 5V_MAIN_VCC]
NetC?#24_1: C?#24.1 C?#25.1 U?#9.15(PGND1)
NetC?#26_1: C?#26.1 C?#27.1 U?#9.1(PGND2)
NetC?#33_1: C?#33.1 L?#3.1 U?#9.16(SW)
NetC?#33_2: C?#33.2 U?#9.3(RBOOT) U?#9.4(CBOOT)
NetC?#34_1: C?#34.1 U?#9.6(VCC) U?#9.9(RT) U?#9.11(SPSP)
NetQ?#9_1: Q?#9.1(G) R?#66.2 R?#67.2
NetQ?#9_3: Q?#9.3(D) R?#65.1 U?#9.13(EN)
NetR?#68_1: R?#68.1 U?#9.10(*RESET)

### Notes on the sheet
- 5V regulator - LM2678 only does 5A, this bad boy does 10 but inductor is only rated for 8 since we need 5
- UNLABELLED RESISTORS ARE 10K

### Library data of the parts
C?#24 C?#27 = CMP-2007-00182-1: Manufacturer: Murata; Part Number: GRM219R61E106KA12D
C?#25 C?#26 = CMP-1040-01539-1: CAP 470nF 50V ±10% 1812 (4532 Metric) Thickness 1.25mm SMD; Tolerance: Â±10%; Case-Metric: 4532; Case-EIA: 1812; Technology: SMT; Max Thickness: 1.25 mm; Value: 470nF; Rated Voltage: 50 V
C?#28-C?#32 = CMP-2007-03222-3: Chip Multilayer Ceramic Capacitors for General Purpose, 0805, 22uF, X5R, 15%, 20%, 25V; Case/Package: 0805; Depth: 1.25mm; Resistor Type: Ceramic; Voltage Rating: 25V; Lead Free: Lead Free; Voltage Rating (DC): 25V; Case Code (Metric): 2012; Thickness: 0.057inch; REACH SVHC: No SVHC; Material: Ceramic; Tolerance: 20%; Length: 2mm; Capacitance: 22uF; Case Code (Imperial): 0805; Max Operating Temperature: 85°C; Termination: SMD/SMT; Weight: 0.000335oz; Dielectric: X5R; Packaging: Tape and Reel; Voltage: 25V; Package Quantity: 3000; Height: 1.25mm; Mount: Surface Mount; Width: 1.25mm; Min Operating Temperature: -55°C
C?#33 = CMP-2000-05393-2: as C?#1 on sheet AMPLIFIER; Voltage: 50V; Dielectric Material: Ceramic; Min Operating Temperature: -55°C; Depth: 0.5mm; Radiation Hardening: No; RoHS Compliant: Yes; Voltage Rating (DC): 50V; Lead Free: Lead Free; Resistor Type: Ceramic; Height: 0.5mm; Dielectric: X7R; Thickness: 0.022inch; Case/Package: 0402; Case Code (Metric): 1005; Termination: SMD/SMT; Capacitance: 100nF; Packaging: Tape and Reel; Max Operating Temperature: 125°C; Mount: Surface Mount; Package Quantity: 1; Width: 0.02inch; Weight: 2.3E-05oz; Voltage Rating: 50V; Tolerance: 10%; Construction: Flat; Case Code (Imperial): 0402; Length: 1mm; REACH SVHC: No SVHC; Series: C
C?#34 = CMP-2000-07531-4: Ceramic Capacitor General Use 1uF ±10% 50V X7R 0603; Series: M; Width: 0.031inch; Mount: Surface Mount; Radiation Hardening: No; Voltage Rating (DC): 50V; Packaging: Tape and Reel; Termination: SMD/SMT; Depth: 0.8mm; Case Code (Metric): 1608; Case Code (Imperial): 0603; Height: 0.8mm; Voltage Rating: 50V; Package Quantity: 1; Halogen Free: Halogen Free; Dielectric: X7R; Min Operating Temperature: -55°C; Length: 1.6mm; Construction: Flat; Tolerance: 10%; Thickness: 0.037inch; Max Operating Temperature: 125°C; Case/Package: 0603; Capacitance: 1uF; RoHS Compliant: Yes
L?#3 = CMP-08253-000021-1: FIXED IND 2.2UH 8.2A 19 MOHM SMD; Manufacturer: TDK; Test Frequency: 100kHz; Shielding: true; Standoff Height: 0.15mm; Core Material: Metal; Saturation Current: 8.4A; Tolerance: 20%; Series Resistance: 19.1mΩ; Automotive: No; Octopart: https://octopart.com/spm6530t-2r2m-tdk-18903909; Mouser Description: Fixed Inductors 2.2uH 0.0173ohms 7.1x6.5x3mm; ComponentLink2URL: https://product.tdk.com/info/en/catalog/datasheets/inductor_commercial_power_spm6530_en.pdf; Height: 3mm; Device Class L2: Inductors; Package: SPM6530; Rms Current: 8.2A; ComponentLink2Description: Datasheet; RoHS: TRUE; Temperature Range Low: -40°C; Digikey Description: FIXED IND 2.2UH 8.2A 19 MOHM SMD; Device Class L1: Passive Components; Device Class L3: Fixed Inductors; Value: 2.2uH; Temperature Range High: +125°C; Inductance: 2.2uH; Temperature: -40°C to +125°C; Lead Free: Yes; Manufacturer Part Number: SPM6530T-2R2M; Composition: Wirewound; Category: Ind
Q?#9 = CMP-2000-05968-1: N-Channel Enhancement Mode Mosfet, 50 V, 200 mA, -55 to 150 degC, 6-Pin SOT-323, RoHS, Tape and Reel; Typical Turn-Off Delay Time: 20ns; Number of Channels: 1Channel; Type: EnhancementModeFieldEffectTransistor; Brand: DiodesIncorporated; Vds - Drain-Source Breakdown Voltage: 75V; Vgs - Gate-Source Voltage: 20V; Rds On - Drain-Source Resistance: 1.4Ohms; Transistor Type: 1N-Channel; Configuration: Single; Unit Weight: 0.000212oz; Pd - Power Dissipation: 200mW; Id - Continuous Drain Current: 200mA; Forward Transconductance - Min: 0.1S; Manufacturer URL: http://www.diodes.com/; Series: BSS138; Package Description: 3-Pin Small Outline Transistor, Body 2 x 1.25 mm, Pitch 0.65 mm; Mounting Technology: SurfaceMount; Product Category: MOSFET; RoHS: True; Maximum Operating Temperature: +150C; Height: 1mm; Length: 2.2mm; Technology: Si; Width: 1.35mm; Datasheet URL: http://www.diodes.com/_files/datasheets/ds30206.pdf; Manufacturer: DiodesIncorporated; Package / Case: SOT-323-3; Typical Turn-On Delay Time: 20ns; Transistor Polarity: N-Channel; Factory Pack Quantity: 3000; Packaging: Reel; Product: MOSFETSmallSignal; Datasheet Version: Rev. 11-2, 09/2013; Package Reference: SOT323; Minimum Operating Temperature: -55C; Mounting Style: SMD/SMT; Channel Mode: Enhancement
R?#63 R?#64 = CMP-2000-00182-1: Manufacturer: Panasonic; Part Number: ERJ-3EKF1003V
R?#65 R?#67 R?#68 = CMP-1012-00623-3: as R?#1 on sheet PWR_MGMT; Number of Pins: 2; Package Reference: 603; Depth: 0.8mm; Mount: SurfaceMount; Package Description: 2-Pin Surface Mount Device, Body 1.6 x 0.85 mm; Datasheet Version: 02/2017; Length: 1.6mm; Lead Free: LeadFree; Height: 0.45mm; Number of Terminations: 2; Max Power Dissipation: 100mW; Min Operating Temperature: -55degC; Datasheet URL: https://industrial.panasonic.com/cdbs/www-data/pdf/RDA0000/AOA0000C304.pdf; Termination: SMD/SMT; Case Code (Metric): 1608; Case Code (Imperial): 0603; Tolerance: 1%; Max Operating Temperature: 155degC; RoHSCompliant: true; Voltage Rating (DC): 75V; Radiation Hardening: No; Packaging: TapeandReel; Composition: ThickFilm; Mounting Technology: SurfaceMount; Manufacturer URL: http://www.panasonic.com/; Width: 0.031inch; REACH SVHC: NoSVHC; Contact Plating: Tin; Military Standard: Not; Package Quantity: 1
R?#66 = CMP-2000-00180-1: Manufacturer: Panasonic; Part Number: ERJ-3EKF1001V
U?#9 = CMP-019-00059-1: 10-A automotive buck converter optimized for power density and low EMI 16-VQFN-HR -40 to 150

## Sheet 5V_AUX.SchDoc
size A4; SheetNumber: 6; SheetTotal: 8
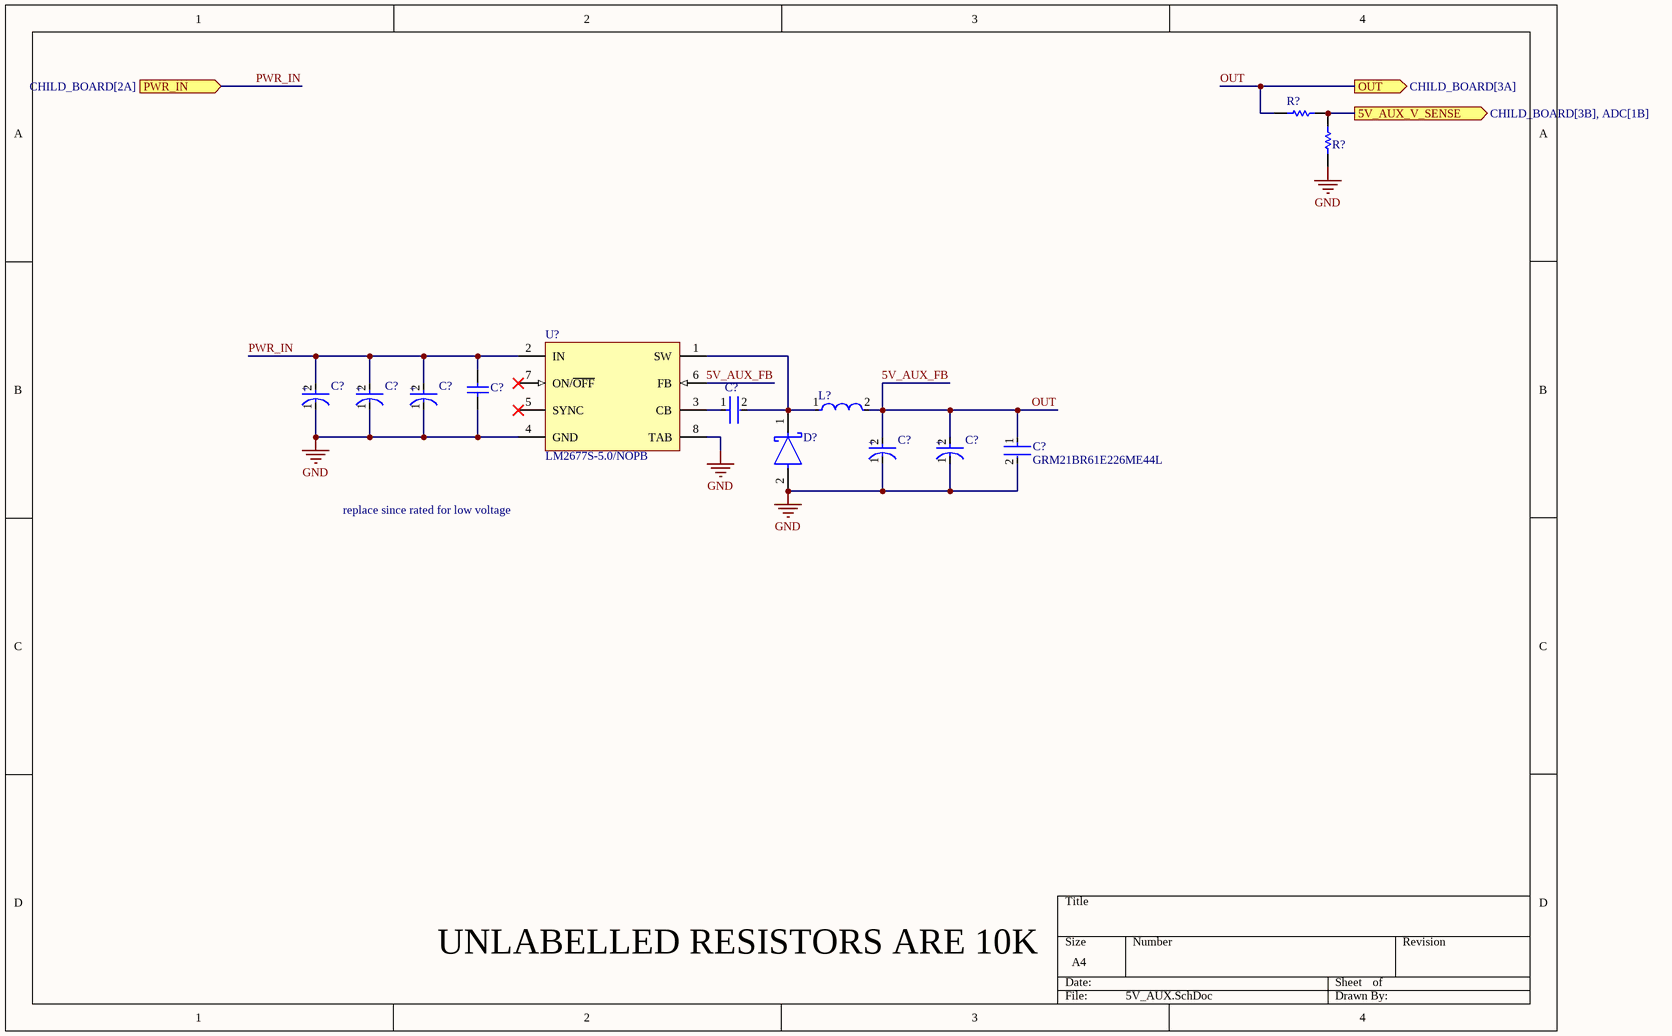
[diagram p5: 5V_AUX.SchDoc]

### Parts
(Parts that share a designator on the sheet are numbered #1, #2 ... from top to bottom, then left to right.)
C?#35  T491B156K025AT  [FP-POSCAP-B2-MFG]  (value not drawn)
C?#36  T491B156K025AT  [FP-POSCAP-B2-MFG]  (value not drawn)
C?#37  T491B156K025AT  [FP-POSCAP-B2-MFG]  (value not drawn)
C?#38  CAP 470nF 50V 1812(4532)  [CAPC1812(4532)125_M]  (value not drawn)
C?#39  C0805C103J5RACTU  [FP-C0805C-DN-MFG]  (value not drawn)
C?#40  16SVPF180M  [FP-OS-CON-SMT-C6-MFG]  (value not drawn)
C?#41  16SVPF180M  [FP-OS-CON-SMT-C6-MFG]  (value not drawn)
C?#42  GRM21BR61E226ME44L  [FP-GRM21B-0_2-e0_2_0_7-IPC_B]
D?#4  B540C-13-F  [FP-SMC-MFG]  (value not drawn)
L?#4  IHLP4040DZER220M11  [FP-IHLP-4040DZ-FP_3_124x3-MFG]  (value not drawn)
R?#69  ERJ3EKF1002V  [RESC1609X55X30LL15T15]  (value not drawn)
R?#70  ERJ3EKF1002V  [RESC1609X55X30LL15T15]  (value not drawn)
U?#10  LM2677S-5.0/NOPB  [KTW0007B_N]

### Ports
5V_AUX_V_SENSE (out, see CHILD_BOARD[3B], ADC[1B]), OUT (out, see CHILD_BOARD[3A]), PWR_IN (in, see CHILD_BOARD[2A])

### Nets
5V_AUX_FB: C?#40.2(A) C?#41.2(A) C?#42.1 L?#4.2 R?#69.1 U?#10.6(FB) ; port OUT  [also labelled OUT]
GND: C?#35.1(C) C?#36.1(C) C?#37.1(C) C?#38.1 C?#40.1(C) C?#41.1(C) C?#42.2 D?#4.2(A) R?#70.1 U?#10.4(GND) U?#10.8(TAB)
5V_AUX_V_SENSE: R?#69.2 R?#70.2 ; port 5V_AUX_V_SENSE
PWR_IN: C?#35.2(A) C?#36.2(A) C?#37.2(A) C?#38.2 U?#10.2(IN) ; port PWR_IN  [project net 5V_AUX_VCC]
NetC?#39_1: C?#39.1 U?#10.3(CB)
NetC?#39_2: C?#39.2 D?#4.1(C) L?#4.1 U?#10.1(SW)

Not connected (* = marked no-connect by the designer): U?#10 5(SYNC)* 7(ON/~{OFF})*

### Notes on the sheet
- replace since rated for low voltage
- UNLABELLED RESISTORS ARE 10K
- (in symbol CMP-05428-001076-1) +
- (in symbol CMP-05428-001090-1) +

### Library data of the parts
C?#35-C?#37 = CMP-05428-001076-1: USE T491B156K025AT / Molded Tantalum Polymer Capacitor 15uF 20% 16V life 2000Hours SMD 1411; Dissipation Factor: 10%; Ripple Current: 1A; Leakage Current: 72uA; ESR (Equivalent Series Resistance): 90mR; Polarity: Polar; Height: 1.9mm; Height - Seated (Max): 0.079inch; Min Operating Temperature: -55°C; Case Code (Imperial): 1210; Package Quantity: 2000; Mount: Surface Mount; RoHS Compliant: Yes; Voltage Rating: 16V; Packaging: Tape and Reel; Number of Pins: 2; Features: General Purpose; Depth: 2.8mm; Case/Package: 1411; Case Code (Metric): 3528; Length: 3.5mm; Termination: SMD/SMT; Lead Free: Lead Free; Life (Hours): 2000Hour; Series: POSCAP™ TQC; Radiation Hardening: No; Voltage Rating (DC): 16V; Voltage: 16V; Capacitance: 15uF; REACH SVHC: No SVHC; Construction: Flat; Tolerance: 20%; Width: 2.8mm; Max Operating Temperature: 105°C
C?#38 = CMP-1040-01539-1: as C?#25 on sheet 5V_MAIN; Technology: SMT; Max Thickness: 1.25 mm; Value: 470nF; Rated Voltage: 50 V
C?#39 = CMP-2007-00254-2: CAP CER 10000PF 50V X7R 0805; Manufacturer: KEMET; Value: 10,000 pF; Material: Ceramic; Temperature Coefficient: 30ppm/°C; Tolerance: 0.05; Device Class L1: Passive Components; Temperature: -55°C to +125°C; Lead Free: Yes; ComponentLink2URL: https://content.kemet.com/datasheets/KEM_C1003_C0G_SMD.pdf; Device Class L3: Ceramic Capacitors; Temperature Characteristic: X7R; Temperature Range High: +125°C; Mouser Description: Capacitor; Ceramic; Cap 0.01uF; Tol 5%; Vol-Rtg 50 V; SMT; Case 0805; X7R; TR; ComponentLink2Description: Datasheet; Manufacturer Part Number: C0805C103J5RACTU; Height: 0.88mm; Digikey Description: CAP CER 10000PF 50V X7R 0805; Capacitance: 10,000 pF; Temperature Range Low: -55°C; Device Class L2: Capacitors; Octopart: https://octopart.com/c0805c103j5ractu-kemet-133473; Voltage Rating: 50 V; Category: Cap; RoHS: TRUE; Automotive: No; Package: C0805C-DN; Ipc Land Pattern Name: CAPC200125X78
C?#40 C?#41 = CMP-05428-001090-1: Conductive Polymer Aluminum Solid Capacitors (OS-CON) 180uF ±20% 16V; Polarity: Polar; Dissipation Factor: 12%; Ripple Current: 3.3A; ESR (Equivalent Series Resistance): 22mR; Leakage Current: 576uA; Life (Hours): 5000Hour; Min Operating Temperature: -55°C; REACH SVHC: No SVHC; Height: 5.9mm; Case/Package: Radial; Packaging: Tape and Reel; Termination: SMD/SMT; Max Operating Temperature: 105°C; Capacitance: 180uF; Package Quantity: 1; RoHS Compliant: Yes; Number of Pins: 6; Tolerance: 20%; Lead Free: Lead Free; Mount: Surface Mount; Voltage Rating: 16V; Length: 5.9mm; Height - Seated (Max): 0.236inch; Voltage Rating (DC): 16V; Radiation Hardening: No; Voltage: 16V; Diameter: 6.3mm; Series: OS-CON™, SVPF; Ripple Current (AC): 3.3A; Construction: Cylindrical
C?#42 = CMP-2007-03222-3: as C?#28 on sheet 5V_MAIN; Case/Package: 0805; Depth: 1.25mm; Resistor Type: Ceramic; Voltage Rating: 25V; Lead Free: Lead Free; Voltage Rating (DC): 25V; Case Code (Metric): 2012; Thickness: 0.057inch; REACH SVHC: No SVHC; Material: Ceramic; Tolerance: 20%; Length: 2mm; Capacitance: 22uF; Case Code (Imperial): 0805; Max Operating Temperature: 85°C; Termination: SMD/SMT; Weight: 0.000335oz; Dielectric: X5R; Packaging: Tape and Reel; Voltage: 25V; Package Quantity: 3000; Height: 1.25mm; Mount: Surface Mount; Width: 1.25mm; Min Operating Temperature: -55°C
D?#4 = CMP-2000-05097-3: DIODE SCHOTTKY 40V 5A SMC; Manufacturer: Diodes Inc.; Automotive Grade: NA; Peak Reverse Current: 0.5mA; Value: 300pF; Max Junction Temp: +150°C; Max Surge Forward Current: 100A; Standoff Height: 0.1mm; Digikey Description: DIODE SCHOTTKY 40V 5A SMC; Temperature Range Low: -55°C; Manufacturer Part Number: B540C-13-F; Octopart: https://octopart.com/b540c-13-f-diodes+inc.-325873; Lead Free: Yes; Reverse Voltage: 40V; RoHS: TRUE; Category: Diode; Mouser Description: Diode: Schottky rectifying; SMD; 40V; 5A; SMC; Package: reel, tape; ComponentLink2Description: Datasheet; Temperature Range High: +150°C; Automotive: No; Footprint Url: https://www.diodes.com/assets/Package-Files/SMC.pdf; Device Class L3: Schottky Diodes; Height: 2.5mm; Forward Current: 5A; Temperature: -55°C to +150°C; Package: SMC; ComponentLink2URL: https://www.diodes.com/assets/Datasheets/ds13012.pdf; Device Class L2: Diodes; Max Repetitive Reverse Voltage: 40V; Device Class L1: Discrete Semiconductors; Capacitance: 300pF
L?#4 = CMP-02424-000785-1: Commercial Inductors, Low DCR Series 22uH 5A 66mΩ 20%; Shielding: Shielded; Max DC Current: 4.5A; Test Frequency: 100kHz; DC Resistance (DCR): 66mR; Self Resonant Frequency: 1MHz; Core Material: Metal; Series: IHLP-4040DZ-11; Min Operating Temperature: -55°C; Rated Current-Max: 5A; Current Rating: 5A; Military Standard: Not; Depth: 10.3mm; Height - Seated (Max): 0.157inch; Contact Plating: Tin; Termination: SMD/SMT; Length: 0.43inch; Package Quantity: 1; Width: 0.405inch; Inductance Tolerance: 20%; Tolerance: 20%; Height: 4mm; RMS Current (Irms): 5A; Saturation Current: 4.5A; Inductance: 22uH; Mount: Surface Mount; Max Operating Temperature: 125°C; Case/Package: 4040; Packaging: Tape and Reel; Radiation Hardening: No; RoHS Compliant: Yes; Lead Free: Lead Free
R?#69 R?#70 = CMP-1012-00623-3: as R?#1 on sheet PWR_MGMT; Number of Pins: 2; Package Reference: 603; Depth: 0.8mm; Mount: SurfaceMount; Package Description: 2-Pin Surface Mount Device, Body 1.6 x 0.85 mm; Datasheet Version: 02/2017; Length: 1.6mm; Lead Free: LeadFree; Height: 0.45mm; Number of Terminations: 2; Max Power Dissipation: 100mW; Min Operating Temperature: -55degC; Datasheet URL: https://industrial.panasonic.com/cdbs/www-data/pdf/RDA0000/AOA0000C304.pdf; Termination: SMD/SMT; Case Code (Metric): 1608; Case Code (Imperial): 0603; Tolerance: 1%; Max Operating Temperature: 155degC; RoHSCompliant: true; Voltage Rating (DC): 75V; Radiation Hardening: No; Packaging: TapeandReel; Composition: ThickFilm; Mounting Technology: SurfaceMount; Manufacturer URL: http://www.panasonic.com/; Width: 0.031inch; REACH SVHC: NoSVHC; Contact Plating: Tin; Military Standard: Not; Package Quantity: 1
U?#10 = CMP-0069-00212-3: SIMPLE SWITCHER® High Efficiency 5A Step-Down Voltage Regulator with Sync, 7-pin TO-263, Pb-Free; Manufacturer: Texas Instruments; PackageTopMarking: NSUZXYTTE#*LM2677S*-5.0; PowerWise: N; Code_JEDEC: MO-169-AC; ComponentLink1URL: http://www.ti.com/general/docs/lit/getliterature.tsp?genericPartNumber=LM2677&fileType=pdf; PackageReference: KTW0007B; PinCount: 7; RoHS: Y; PackageDescription: TO-263, Molded, .400 x .390 x .180in Body, 7 Lead, .050in Pitch, Surface Mount; ComponentLink1Description: Datasheet URL; CompType: Switcher